# EAGLE design V1_Flight_Controller (EAGLE 9.5.1)
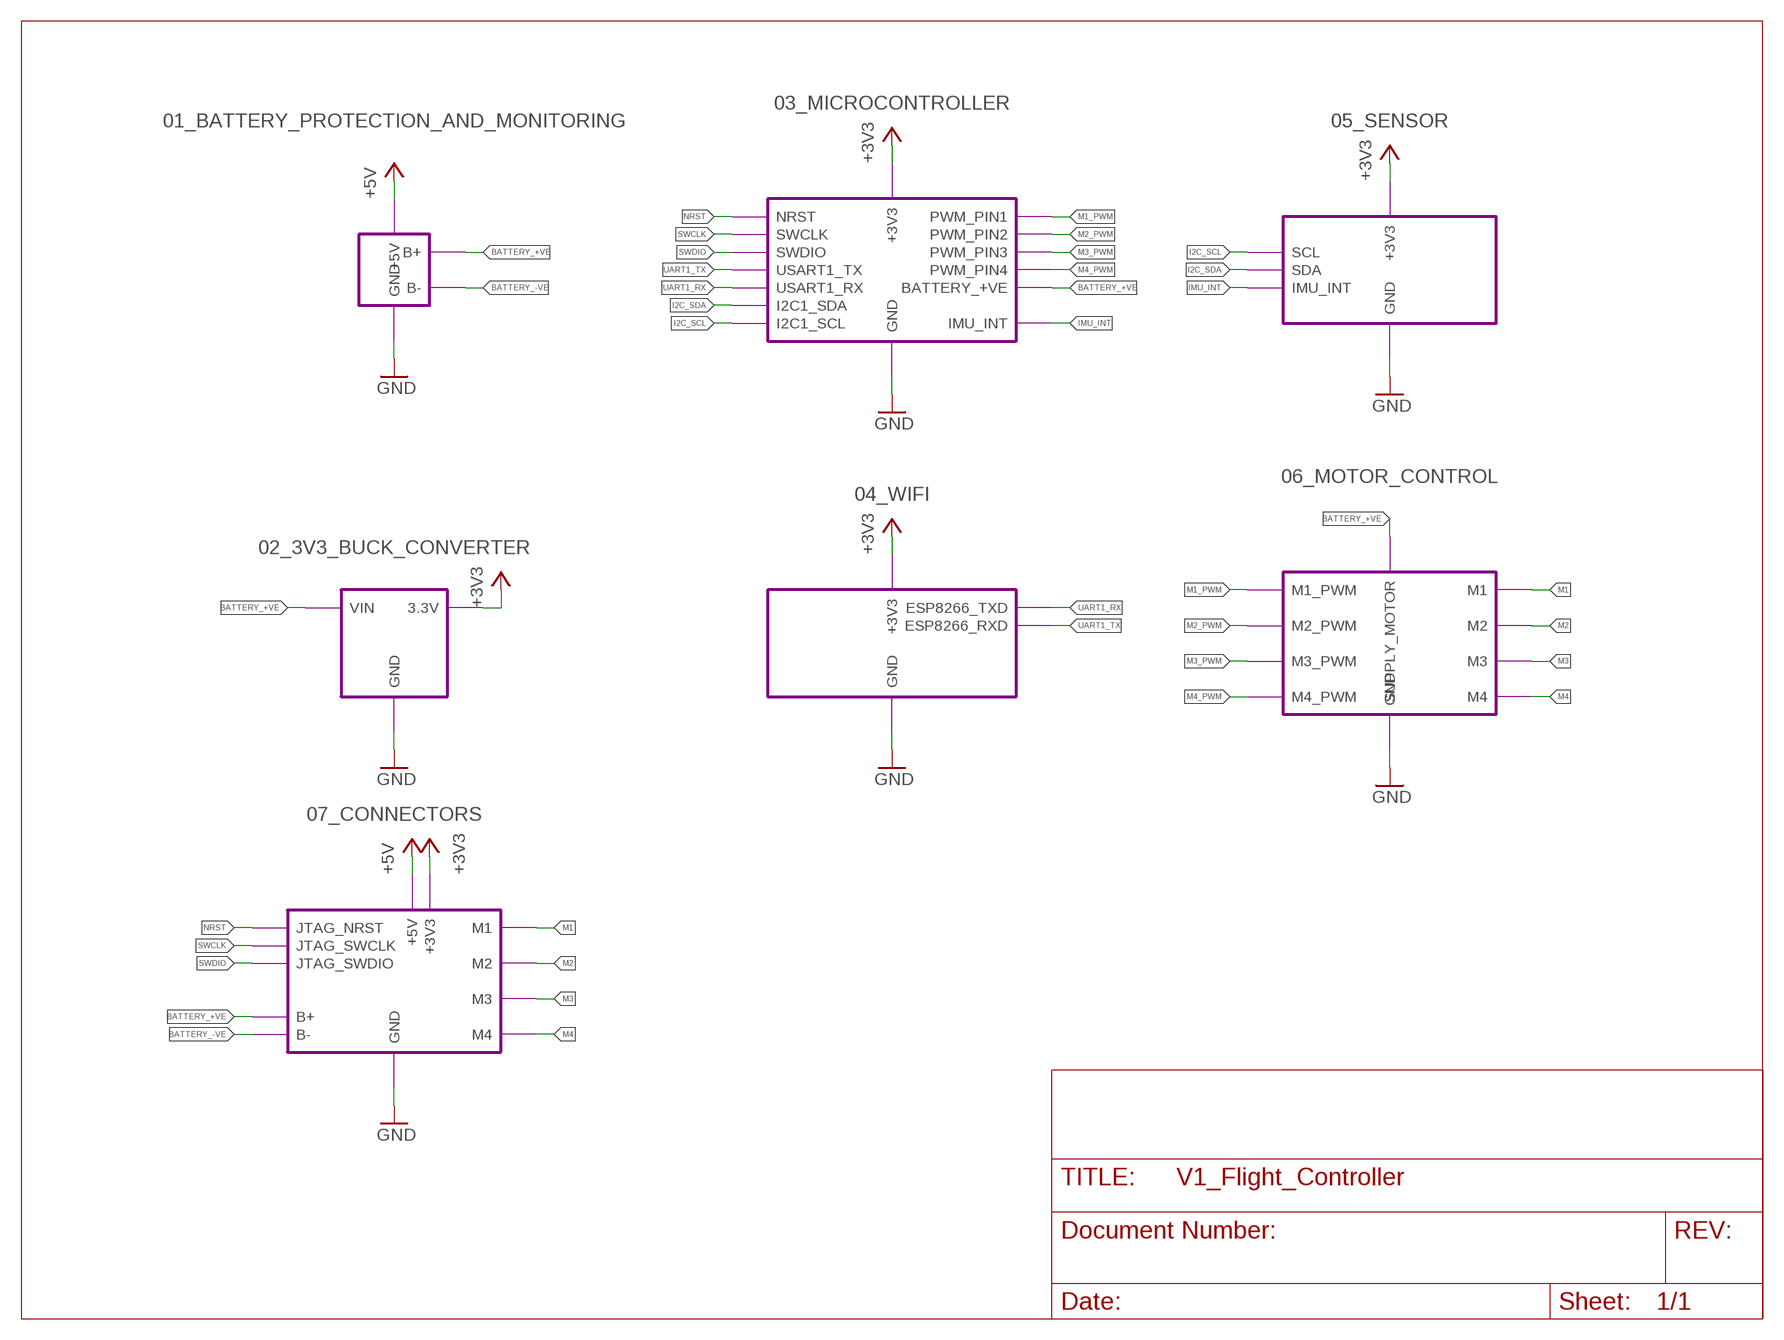
[diagram p0: schematic, sheet 1]

## Module instances
03_MICROCONTROLLER = MICROCONTROLLER
02_3V3_BUCK_CONVERTER = 3V3_BUCK_CONVERTER
01_BATTERY_PROTECTION_AND_MONITORING = BATTERY_PROTECTION_AND_MONITORING
04_WIFI = WIFI
05_SENSOR = SENSOR
06_MOTOR_CONTROL = MOTOR_CONTROL
07_CONNECTORS = CONNECTORS

## Nets
+3V3: port 07_CONNECTORS.+3V3 02_3V3_BUCK_CONVERTER.3.3V 04_WIFI.+3V3 03_MICROCONTROLLER.+3V3 05_SENSOR.+3V3
+5V: port 01_BATTERY_PROTECTION_AND_MONITORING.+5V 07_CONNECTORS.+5V
BATTERY_+VE: port 01_BATTERY_PROTECTION_AND_MONITORING.B+ 07_CONNECTORS.B+ 02_3V3_BUCK_CONVERTER.VIN 06_MOTOR_CONTROL.SUPPLY_MOTOR 03_MICROCONTROLLER.BATTERY_+VE
BATTERY_-VE: port 01_BATTERY_PROTECTION_AND_MONITORING.B- 07_CONNECTORS.B-
GND: port 01_BATTERY_PROTECTION_AND_MONITORING.GND 02_3V3_BUCK_CONVERTER.GND 04_WIFI.GND 06_MOTOR_CONTROL.GND 05_SENSOR.GND 03_MICROCONTROLLER.GND 07_CONNECTORS.GND
I2C_SCL: port 03_MICROCONTROLLER.I2C1_SCL
I2C_SDA: port 03_MICROCONTROLLER.I2C1_SDA
M1: port 07_CONNECTORS.M1 06_MOTOR_CONTROL.M1
M1_PWM: port 06_MOTOR_CONTROL.M1_PWM 03_MICROCONTROLLER.PWM_PIN1
M2: port 07_CONNECTORS.M2 06_MOTOR_CONTROL.M2
M2_PWM: port 03_MICROCONTROLLER.PWM_PIN2 06_MOTOR_CONTROL.M2_PWM
M3: port 07_CONNECTORS.M3 06_MOTOR_CONTROL.M3
M3_PWM: port 03_MICROCONTROLLER.PWM_PIN3 06_MOTOR_CONTROL.M3_PWM
M4: port 07_CONNECTORS.M4 06_MOTOR_CONTROL.M4
M4_PWM: port 03_MICROCONTROLLER.PWM_PIN4 06_MOTOR_CONTROL.M4_PWM
NRST: port 03_MICROCONTROLLER.NRST 07_CONNECTORS.JTAG_NRST
SWCLK: port 03_MICROCONTROLLER.SWCLK 07_CONNECTORS.JTAG_SWCLK
SWDIO: port 03_MICROCONTROLLER.SWDIO 07_CONNECTORS.JTAG_SWDIO
UART1_RX: port 03_MICROCONTROLLER.USART1_RX 04_WIFI.ESP8266_TXD
UART1_TX: port 03_MICROCONTROLLER.USART1_TX 04_WIFI.ESP8266_RXD

## Library data of the parts

## Module MICROCONTROLLER
Ports: PWM_PIN1(out) PWM_PIN2(out) PWM_PIN3(out) PWM_PIN4(out) NRST(io) SWCLK(io) SWDIO(io) I2C1_SCL(io) I2C1_SDA(io) USART1_TX(out) USART1_RX(in) IMU_INT(in) +3V3(pwr) GND(pwr) BATTERY_+VE(in)
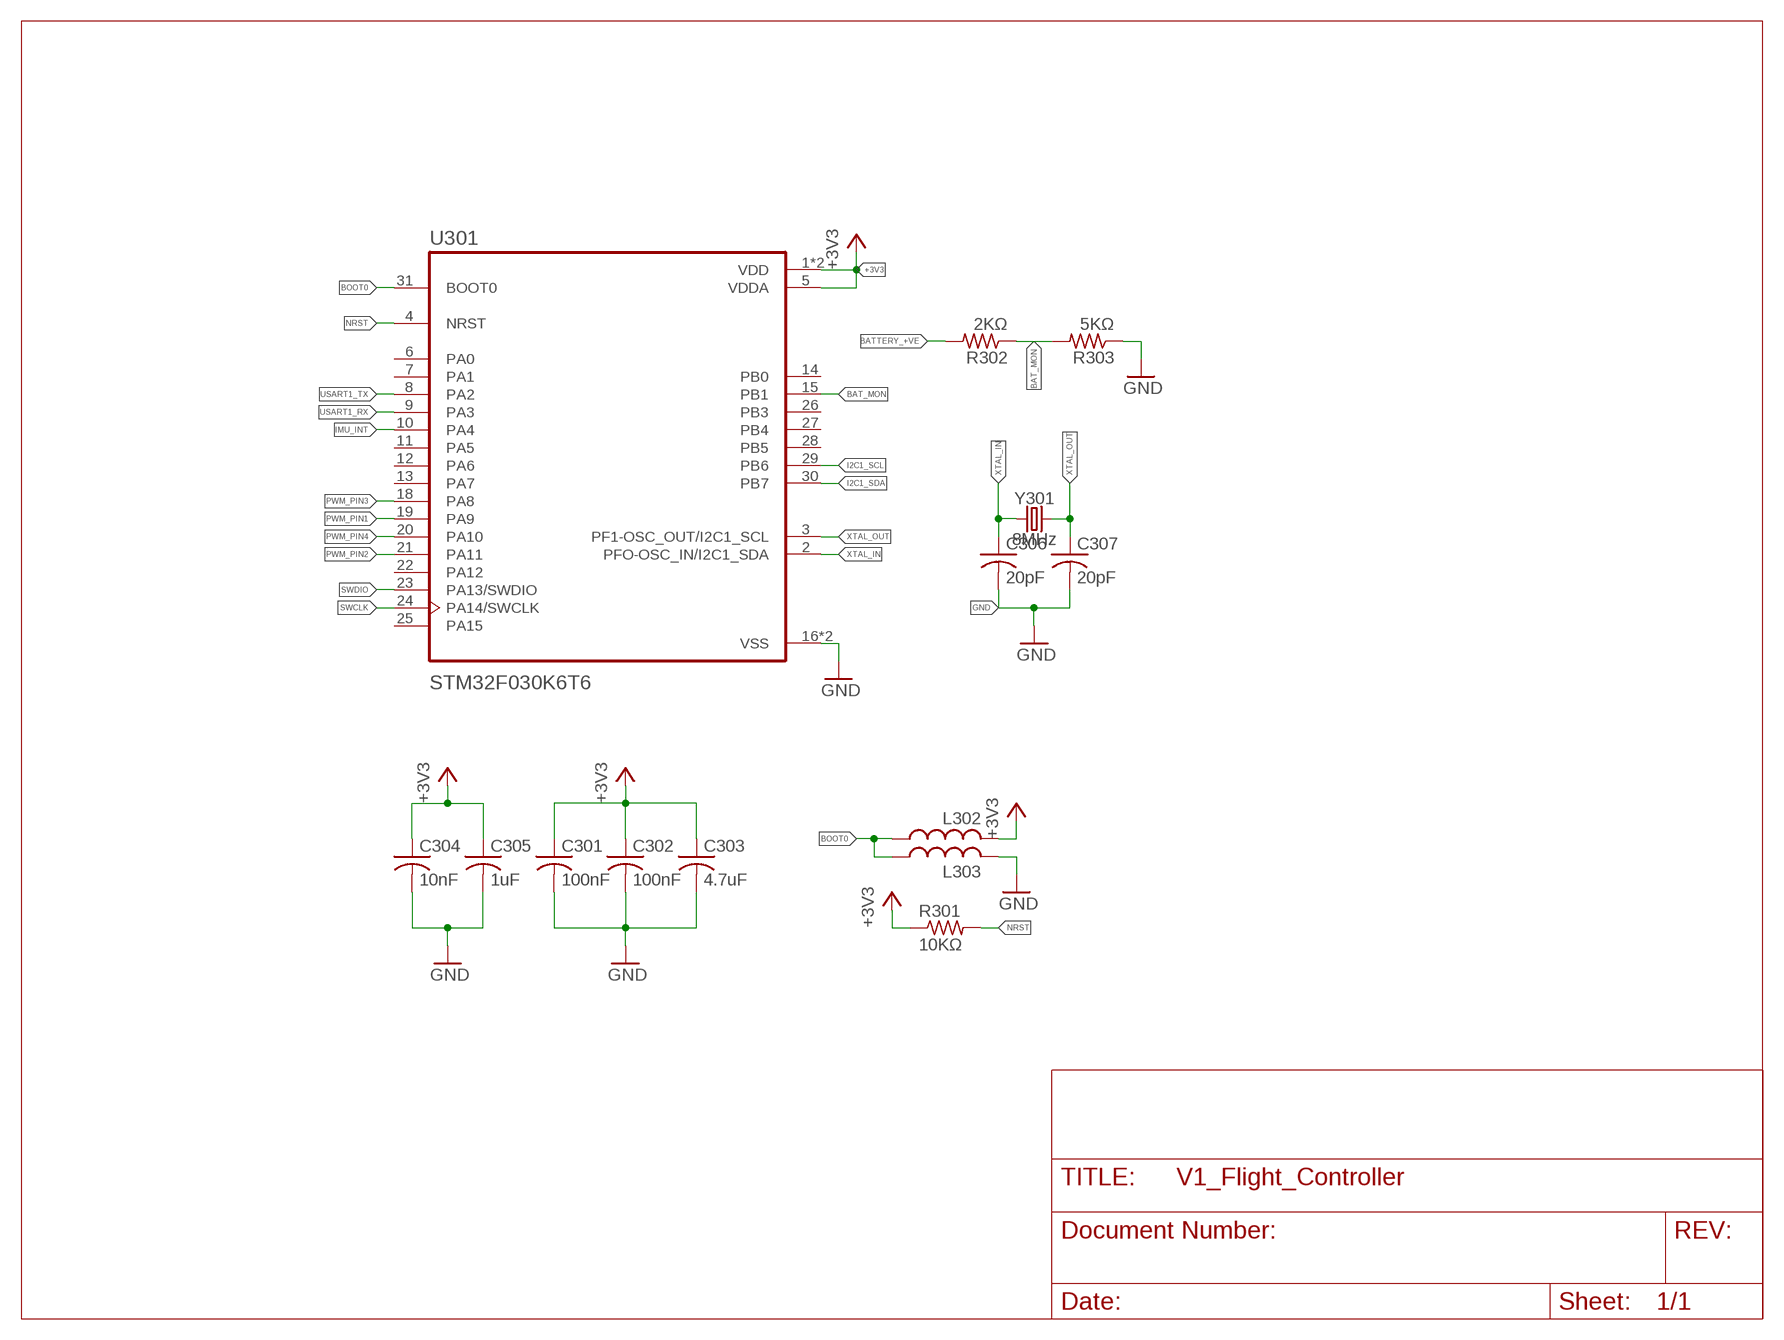
[diagram p1: schematic, module MICROCONTROLLER, sheet 1]

### Parts
C301  100nF  C-USC0603  [C0603]
C302  100nF  C-USC0603  [C0603]
C303  4.7uF  C-USC0603  [C0603]
C304  10nF  C-USC0603  [C0603]
C305  1uF  C-USC0603  [C0603]
C306  20pF  C-USC0603  [C0603]
C307  20pF  C-USC0603  [C0603]
L302  L-USL2012C  [L2012C]
L303  L-USL2012C  [L2012C]
R301  10KΩ  R-US_R0603  [R0603]
R302  2KΩ  R-US_R0603  [R0603]
R303  5KΩ  R-US_R0603  [R0603]
U301  STM32F030K6T6  [QFP80P900X900X160-32N]
Y301  8MHz  CRYSTAL-8MHZSMD-HC49UP  [HC49UP]

### Nets
+3V3: C301.1 C302.1 C303.1 C304.1 C305.1 L302.2 R301.1 U301.1(VDD) U301.5(VDDA) U301.17(VDD)
BAT_MON: R302.1 R303.2 U301.15(PB1)
BATTERY_+VE: R302.2
BOOT0: L302.1 L303.1 U301.31(BOOT0)
GND: C301.2 C302.2 C303.2 C304.2 C305.2 C306.2 C307.2 L303.2 R303.1 U301.16(VSS) U301.32(VSS)
I2C1_SCL: U301.29(PB6)
I2C1_SDA: U301.30(PB7)
IMU_INT: U301.10(PA4)
NRST: R301.2 U301.4(NRST)
PWM_PIN1: U301.19(PA9)
PWM_PIN2: U301.21(PA11)
PWM_PIN3: U301.18(PA8)
PWM_PIN4: U301.20(PA10)
SWCLK: U301.24(PA14/SWCLK)
SWDIO: U301.23(PA13/SWDIO)
USART1_RX: U301.9(PA3)
USART1_TX: U301.8(PA2)
XTAL_IN: C306.1 U301.2(PFO-OSC_IN/I2C1_SDA) Y301.1
XTAL_OUT: C307.1 U301.3(PF1-OSC_OUT/I2C1_SCL) Y301.2
Unconnected: U301.6(PA0) U301.7(PA1) U301.11(PA5) U301.12(PA6) U301.13(PA7) U301.14(PB0) U301.22(PA12) U301.25(PA15) U301.26(PB3) U301.27(PB4) U301.28(PB5)

### Library data of the parts
C301-C307 = adafruit:C-US: CAPACITOR, American symbol
L302 L303 = rcl:L-US: INDUCTOR, American symbol; SPICEPREFIX: L
R301-R303 = adafruit:R-US_: RESISTOR, American symbol
U301 = STM32F030K6T6:STM32F030K6T6: None; AVAILABILITY: Unavailable; DESCRIPTION: MCU 32-Bit STM32F ARM Cortex M0 RISC 32KB Flash 2.5V/3.3V 32-Pin LQFP Tray; MF: STMicroelectronics; MP: STM32F030K6T6; PACKAGE: LQFP-32 STMicroelectronics; PRICE: None
Y301 = SparkFun-Clocks:CRYSTAL-8MHZ: 8MHz Crystal Datasheet Example <http://www.futureelectronics.com/en/technologies/electromechanical/timing-devices/crystals/Pages/6008189-ABM3B-8.000MHZ-B2-T.aspx?IM=0> Frequency: 8MHz Frequency Tolerance: ±20ppm Load Capacitance: 18pF SparkFun Products: Pro Micro -3.3V/8MHz <https://www.sparkfun.com/products/12587> WAV Trigger <https://www.sparkfun.com/products/13660>; PROD_ID: XTAL-11706

## Module 3V3_BUCK_CONVERTER
Ports: VIN(in) 3.3V(pwr) GND(pwr)
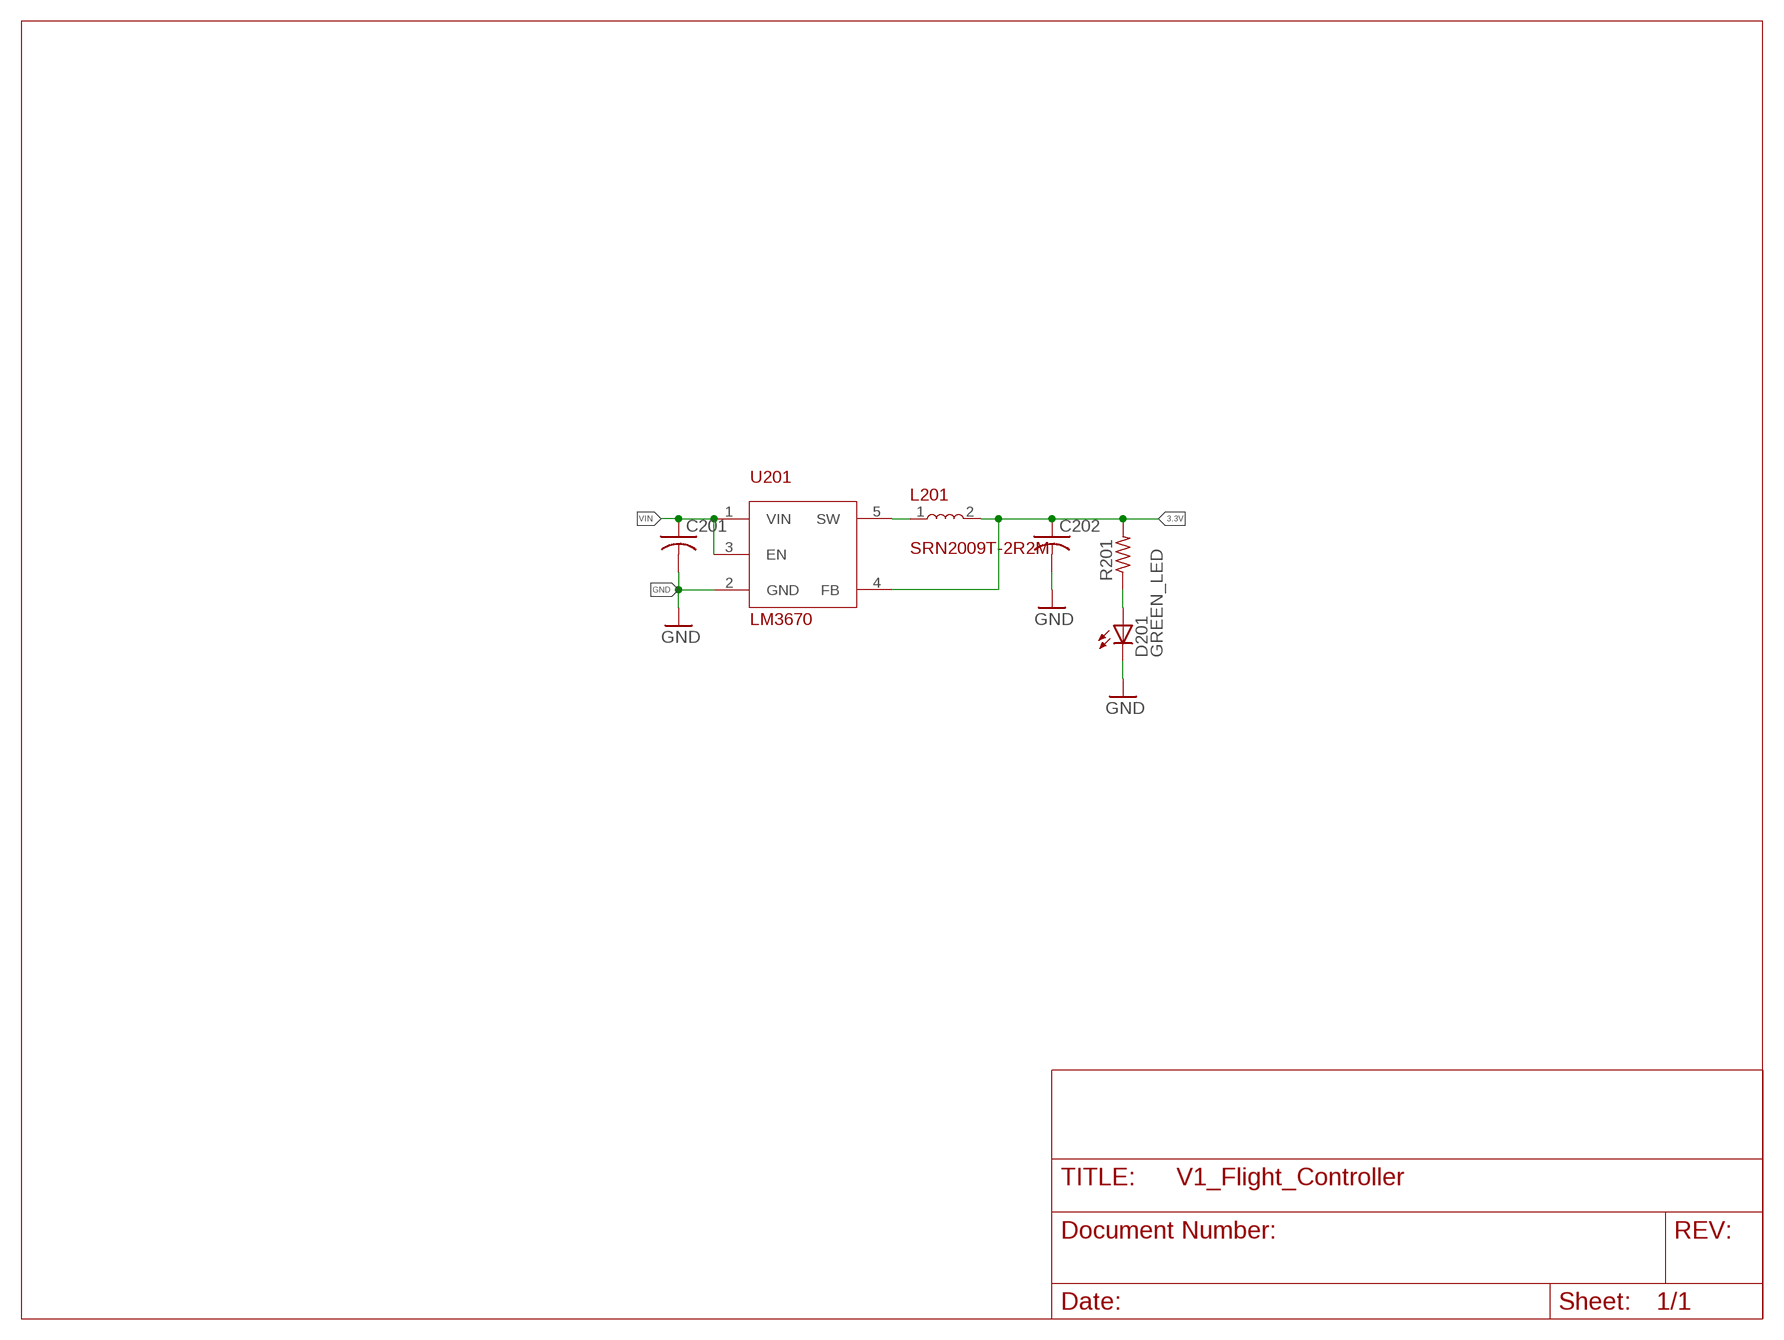
[diagram p2: schematic, module 3V3_BUCK_CONVERTER, sheet 1]

### Parts
C201  C-USC0603K  [C0603K]
C202  C-USC0603K  [C0603K]
D201  GREEN_LED  LEDCHIPLED_0603  [CHIPLED_0603]
L201  SRN2009T-2R2M  [SRN2009T-2R2M]
R201  R-US_R0603  [R0603]
U201  LM3670  [SOT-23-5]

### Nets
3.3V: C202.1 L201.2 R201.2 U201.4(FB)
GND: C201.2 C202.2 D201.C U201.2(GND)
LED_3V3: D201.A R201.1
SW: L201.1 U201.5(SW)
VIN: C201.1 U201.1(VIN) U201.3(EN)

### Library data of the parts
C201 C202 = adafruit:C-US: CAPACITOR, American symbol
D201 = adafruit:LED: LED OSRAM: - CHIPLED LG R971, LG N971, LY N971, LG Q971, LY Q971, LO R971, LY R971 LH N974, LH R974 LS Q976, LO Q976, LY Q976 LO Q996 - Hyper CHIPLED LW Q18S LB Q993, LB Q99A, LB R99A - SideLED LS A670, LO A670, LY A670, LG A670, LP A670 LB A673, LV A673, LT A673, LW A673 LH A674 LY A675 LS A676, LA A676, LO A676, LY A676, LW A676 LS A679, LY A679, LG A679 - Hyper Micro SIDELED® LS Y876, LA Y876, LO Y876, LY Y876 LT Y87S - SmartLED LW L88C, LW L88S LB L89C, LB L89S, LG L890 LS L89K, LO L89K, LY L89K LS L896, LA L896, LO L896, LY L896 - TOPLED LS T670, LO T670, LY T670, LG T670, LP T670 LSG T670, LSP T670, LSY T670, LOP T670, LYG T670 LG T671, LOG T671, LSG T671 LB T673, LV T673, LT T673, LW T673 LH T674 LS T676, LA T676, LO T676, LY T676, LB T676, LH T676, LSB T676, LW T676 LB T67C, LV T67C, LT T67C, LS T67K, LO T67K, LY T67K, LW E67C LS E67B, LA E67B, LO E67B, LY E67B, LB E67C, LV E67C, LT E67C LW T67C LS T679, LY T679, LG T679 LS T770, LO T770, LY T770, LG T770, LP T770 LB T773, LV T773, LT T773, LW T773 LH T774 LS E675, LA E675, LY E675, LS T675 LS T776, LA T776, LO T776, LY T776, LB T776 LHGB T686 LT T68C, LB T68C - Hyper Mini TOPLED® LB M676 - Mini TOPLED Santana® LG M470 LS M47K, LO M47K, LY M47K Source: http://www.osram.convergy.de/
L201 = SRN2009T-2R2M:SRN2009T-2R2M
R201 = adafruit:R-US_: RESISTOR, American symbol
U201 = smd-footprints:LM3670

## Module BATTERY_PROTECTION_AND_MONITORING
Ports: GND(pwr) B+(io) B-(in) +5V(pwr)
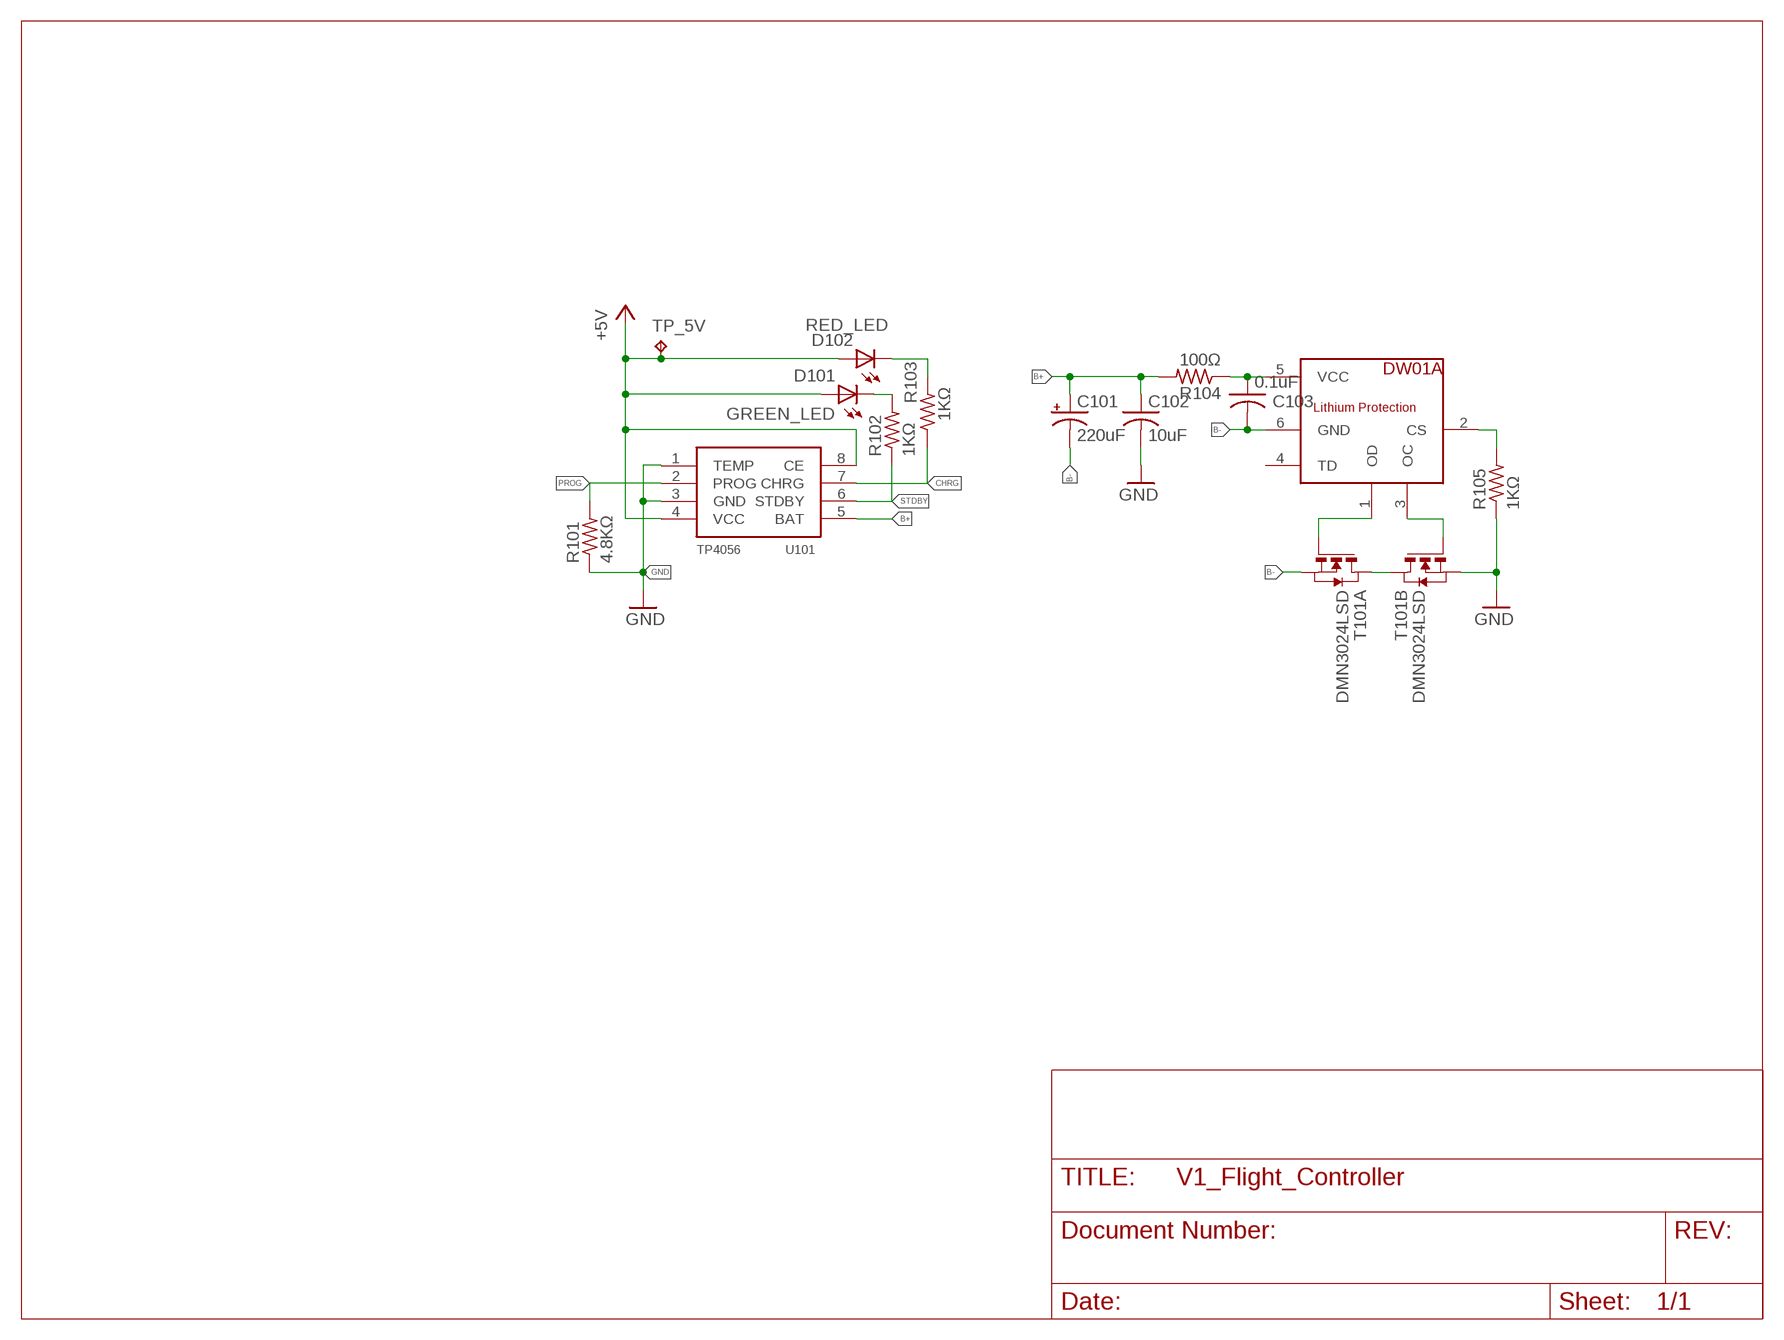
[diagram p3: schematic, module BATTERY_PROTECTION_AND_MONITORING, sheet 1]

### Parts
C101  220uF  CPOL-USD  [PANASONIC_D]
C102  10uF  C-USC0603K  [C0603K]
C103  0.1uF  C-USC0603K  [C0603K]
D101  GREEN_LED  LEDCHIPLED_0603  [CHIPLED_0603]
D102  RED_LED  LEDCHIPLED_0603  [CHIPLED_0603]
R101  4.8KΩ  R-US_R0603  [R0603]
R102  1KΩ  R-US_R0603  [R0603]
R103  1KΩ  R-US_R0603  [R0603]
R104  100Ω  R-US_R0603  [R0603]
R105  1KΩ  R-US_R0603  [R0603]
T101  DMN3024LSD  [TSSOP-8]
TP_5V  TPB1,27  [B1,27]
U101  TP4056  [SOP-8]
U102  DW01A  [SOT23-6]

### Nets
+5V: D101.A D102.A TP_5V.TP U101.4(VCC) U101.8(CE)
B+: C101.+ C102.1 R104.2 U101.5(BAT)
B-: C101.- C103.2 T101.2(A:S) T101.3(A:S) U102.6(GND)
CHRG: R103.1 U101.7(CHRG)
CHRG_LED: D102.C R103.2
CS: R105.2 U102.2(CS)
GND: C102.2 R101.1 R105.1 T101.6(B:S) T101.7(B:S) U101.1(TEMP) U101.3(GND)
N$6: T101.1(A:D) T101.8(B:D)
OC: T101.5(B:G) U102.3(OC)
OD: T101.4(A:G) U102.1(OD)
PROG: R101.2 U101.2(PROG)
STDBY: R102.1 U101.6(STDBY)
STDBY_LED: D101.C R102.2
VCC: C103.1 R104.1 U102.5(VCC)
Unconnected: U102.4(TD)

### Library data of the parts
C101 = adafruit:CPOL-US: POLARIZED CAPACITOR, American symbol
C102 C103 = adafruit:C-US: CAPACITOR, American symbol
D101 D102 = adafruit:LED: LED OSRAM: - CHIPLED LG R971, LG N971, LY N971, LG Q971, LY Q971, LO R971, LY R971 LH N974, LH R974 LS Q976, LO Q976, LY Q976 LO Q996 - Hyper CHIPLED LW Q18S LB Q993, LB Q99A, LB R99A - SideLED LS A670, LO A670, LY A670, LG A670, LP A670 LB A673, LV A673, LT A673, LW A673 LH A674 LY A675 LS A676, LA A676, LO A676, LY A676, LW A676 LS A679, LY A679, LG A679 - Hyper Micro SIDELED® LS Y876, LA Y876, LO Y876, LY Y876 LT Y87S - SmartLED LW L88C, LW L88S LB L89C, LB L89S, LG L890 LS L89K, LO L89K, LY L89K LS L896, LA L896, LO L896, LY L896 - TOPLED LS T670, LO T670, LY T670, LG T670, LP T670 LSG T670, LSP T670, LSY T670, LOP T670, LYG T670 LG T671, LOG T671, LSG T671 LB T673, LV T673, LT T673, LW T673 LH T674 LS T676, LA T676, LO T676, LY T676, LB T676, LH T676, LSB T676, LW T676 LB T67C, LV T67C, LT T67C, LS T67K, LO T67K, LY T67K, LW E67C LS E67B, LA E67B, LO E67B, LY E67B, LB E67C, LV E67C, LT E67C LW T67C LS T679, LY T679, LG T679 LS T770, LO T770, LY T770, LG T770, LP T770 LB T773, LV T773, LT T773, LW T773 LH T774 LS E675, LA E675, LY E675, LS T675 LS T776, LA T776, LO T776, LY T776, LB T776 LHGB T686 LT T68C, LB T68C - Hyper Mini TOPLED® LB M676 - Mini TOPLED Santana® LG M470 LS M47K, LO M47K, LY M47K Source: http://www.osram.convergy.de/
R101-R105 = adafruit:R-US_: RESISTOR, American symbol
T101 = FS8205A:DMN3024LSD: DUAL N-CHANNEL ENHANCEMENT MODE MOSFET data sheet <http://goo.gl/dRgboR> Dave.Calaway Eagle Library <https://goo.gl/Muy1Tr>
TP_5V = testpad:TP: Test pad
U101 = tp4056:TP4056
U102 = dw01a:DW01A

## Module WIFI
Ports: ESP8266_TXD(out) ESP8266_RXD(in) +3V3(pwr) GND(pwr)
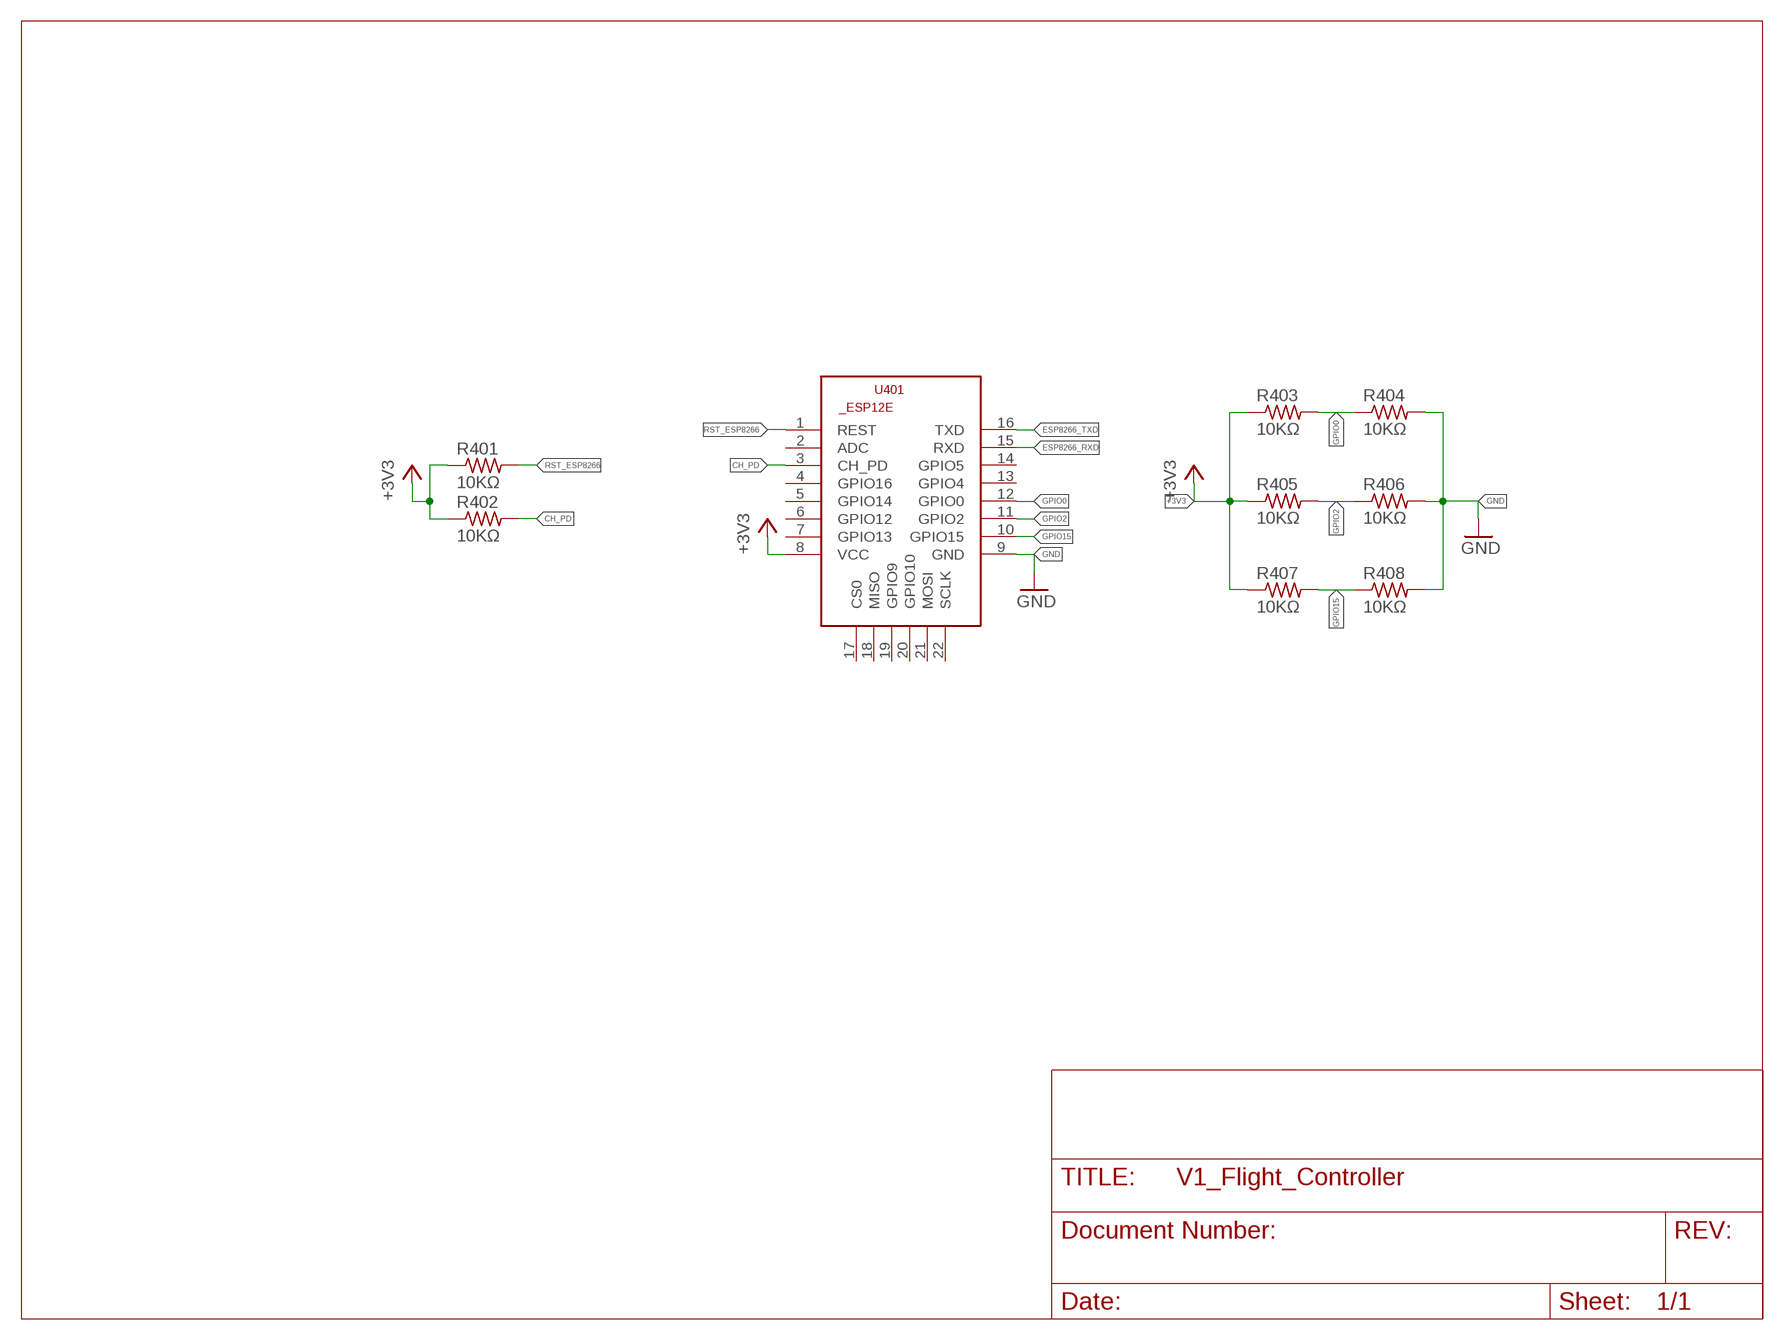
[diagram p4: schematic, module WIFI, sheet 1]

### Parts
R401  10KΩ  R-US_R0603  [R0603]
R402  10KΩ  R-US_R0603  [R0603]
R403  10KΩ  R-US_R0603  [R0603]
R404  10KΩ  R-US_R0603  [R0603]
R405  10KΩ  R-US_R0603  [R0603]
R406  10KΩ  R-US_R0603  [R0603]
R407  10KΩ  R-US_R0603  [R0603]
R408  10KΩ  R-US_R0603  [R0603]
U401  ESP8266-12EESP12E  [ESP8266-ESP12E]

### Nets
+3V3: R401.1 R402.1 R403.1 R405.1 R407.1 U401.8(VCC)
CH_PD: R402.2 U401.3(CH_PD)
ESP8266_RXD: U401.15(RXD)
ESP8266_TXD: U401.16(TXD)
GND: R404.2 R406.2 R408.2 U401.9(GND)
GPIO0: R403.2 R404.1 U401.12(GPIO0)
GPIO2: R405.2 R406.1 U401.11(GPIO2)
GPIO15: R407.2 R408.1 U401.10(GPIO15)
RST_ESP8266: R401.2 U401.1(REST)
Unconnected: U401.2(ADC) U401.4(GPIO16) U401.5(GPIO14) U401.6(GPIO12) U401.7(GPIO13) U401.13(GPIO4) U401.14(GPIO5) U401.17(CS0) U401.18(MISO) U401.19(GPIO9) U401.20(GPIO10) U401.21(MOSI) U401.22(SCLK)

### Library data of the parts
R401-R408 = adafruit:R-US_: RESISTOR, American symbol
U401 = esp12e:ESP8266-12E: ESP8266-12E Library for Eagle CAD The author not responsible for any damages or errors!. Created by Suhail jr.lt;/author>

## Module SENSOR
Ports: SCL(io) SDA(io) IMU_INT(out) GND(pwr) +3V3(pwr)
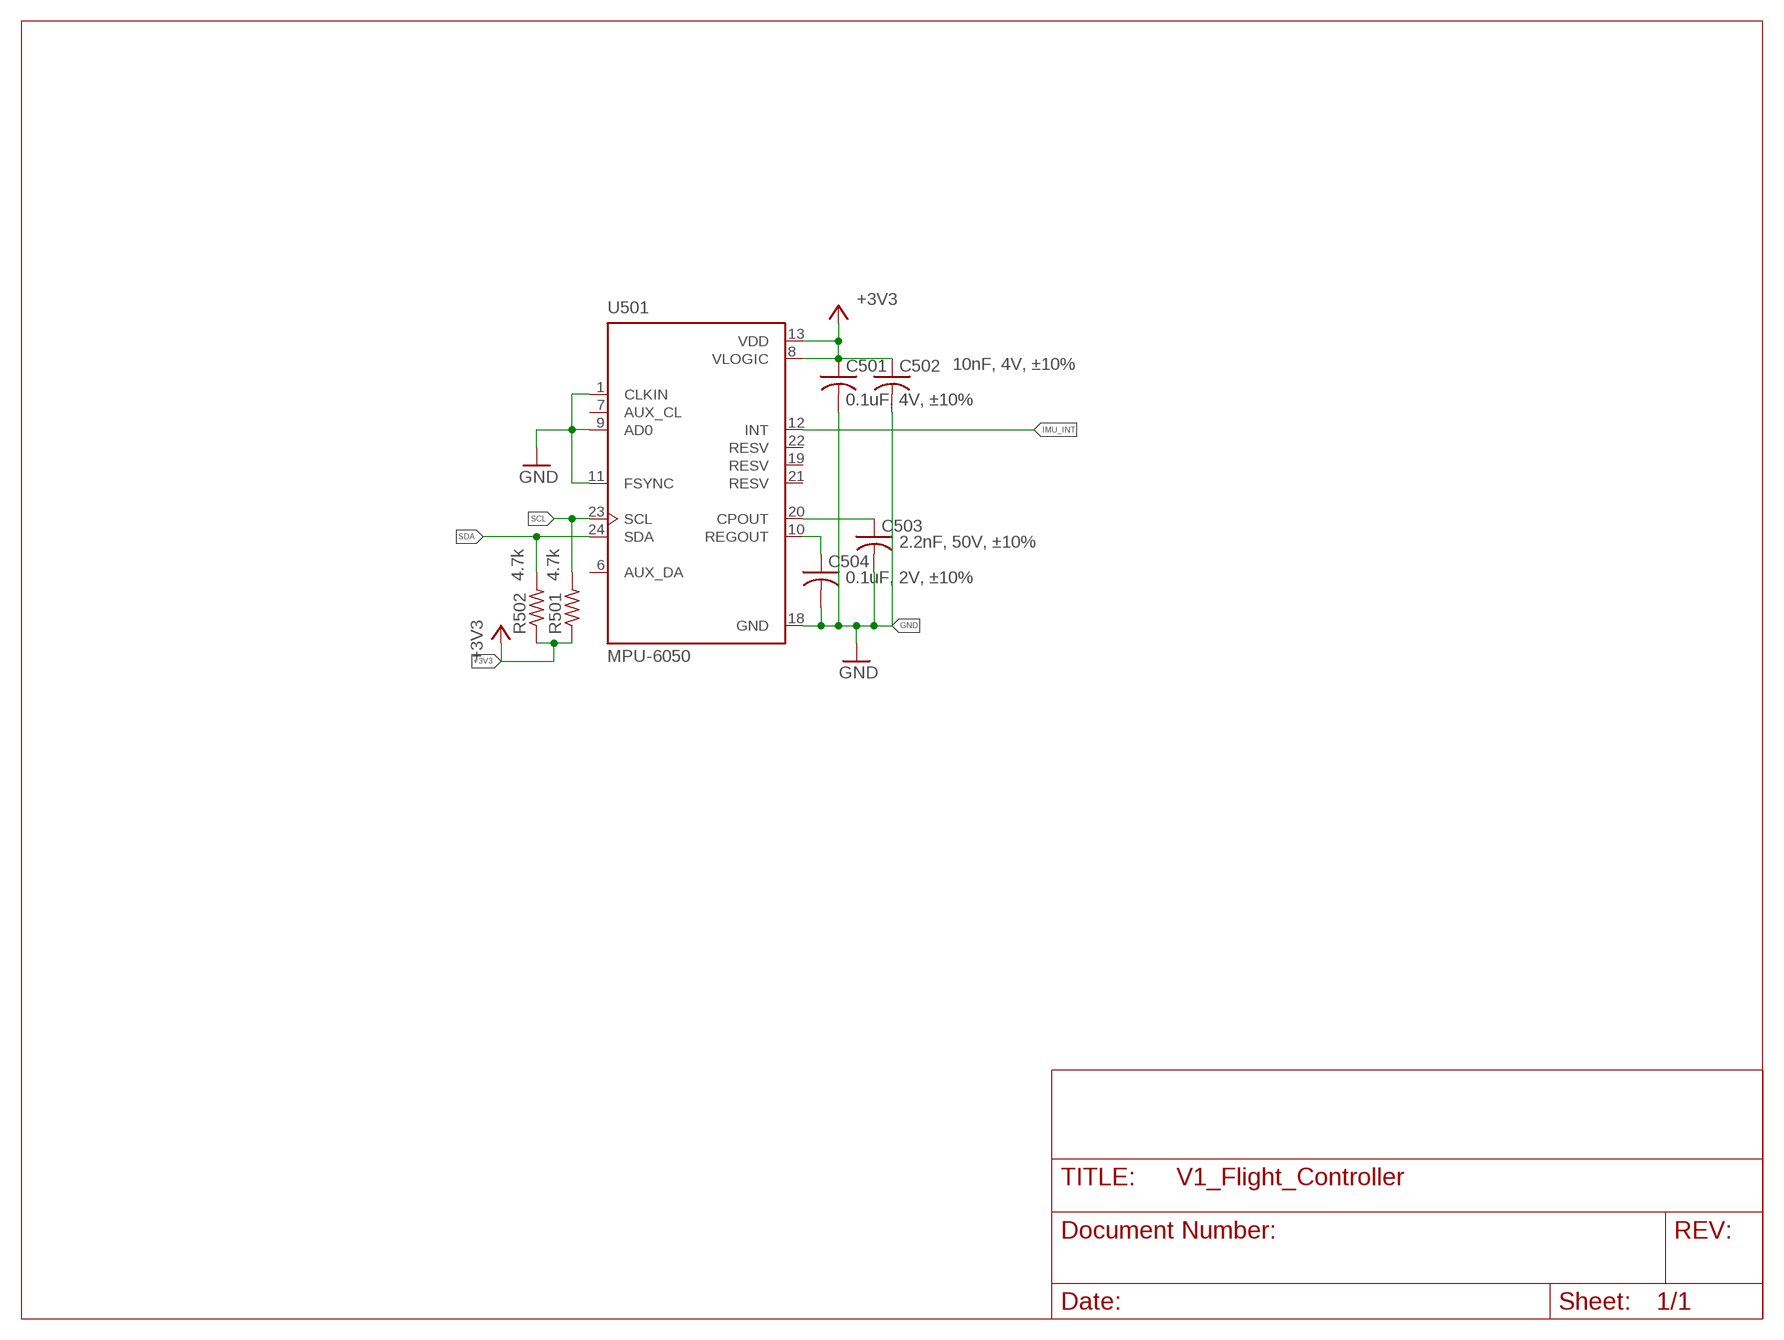
[diagram p5: schematic, module SENSOR, sheet 1]

### Parts
C501  0.1uF, 4V, ±10%  C-USC0603  [C0603]
C502  10nF, 4V, ±10%  C-USC0603  [C0603]
C503  2.2nF, 50V, ±10%  C-USC0603  [C0603]
C504  0.1uF, 2V, ±10%  C-USC0603  [C0603]
R501  4.7k  R-US_R0603  [R0603]
R502  4.7k  R-US_R0603  [R0603]
U501  MPU-6050  [QFN50P400X400X95-24N]

### Nets
+3V3: C501.1 C502.1 R501.1 R502.1 U501.8(VLOGIC) U501.13(VDD)
CPOUT: C503.1 U501.20(CPOUT)
GND: C501.2 C502.2 C503.2 C504.2 U501.1(CLKIN) U501.9(AD0) U501.11(FSYNC) U501.18(GND)
IMU_INT: U501.12(INT)
REGOUT: C504.1 U501.10(REGOUT)
SCL: R501.2 U501.23(SCL)
SDA: R502.2 U501.24(SDA)
Unconnected: U501.6(AUX_DA) U501.7(AUX_CL) U501.19(RESV) U501.21(RESV) U501.22(RESV)

### Library data of the parts
C501-C504 = adafruit:C-US: CAPACITOR, American symbol
R501 R502 = adafruit:R-US_: RESISTOR, American symbol
U501 = MPU-6050:MPU-6050: MPU-6050 Six-Axis (Gyro + Accelerometer) MEMS MotionTracking™ Devices; AVAILABILITY: Unavailable; DESCRIPTION: 3-axis gyroscope, 3-axis accelerometer in a 4x4x0.9 housing; MF: TDK InvenSense; MP: MPU-6050; PACKAGE: QFN-24 InvenSense; PRICE: None

## Module MOTOR_CONTROL
Ports: SUPPLY_MOTOR(in) M1(in) M1_PWM(in) M2_PWM(in) M3_PWM(in) M4_PWM(in) M2(in) M3(in) M4(in) GND(pwr)
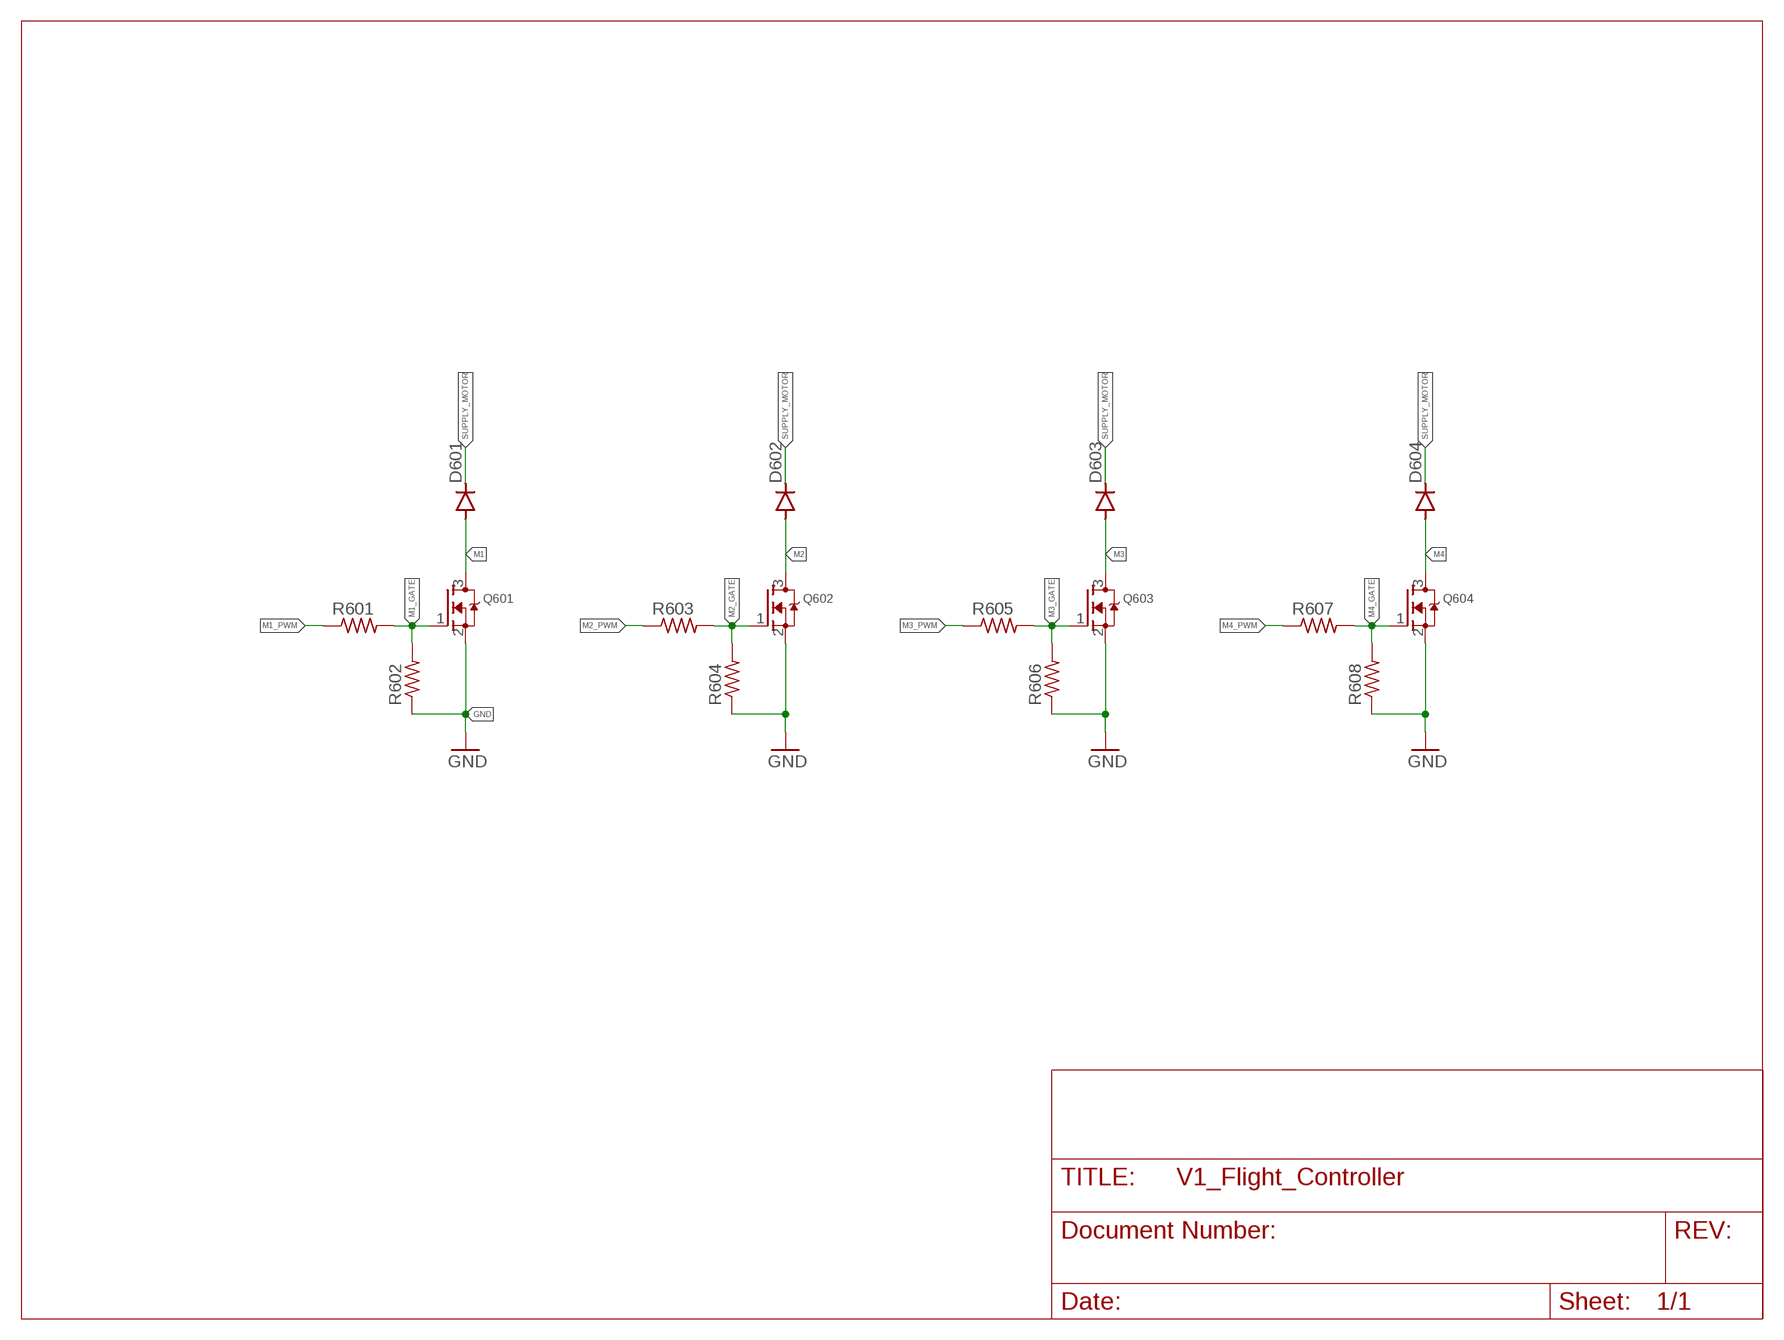
[diagram p6: schematic, module MOTOR_CONTROL, sheet 1]

### Parts
D601  DIODE-SOD123  [SOD123]
D602  DIODE-SOD123  [SOD123]
D603  DIODE-SOD123  [SOD123]
D604  DIODE-SOD123  [SOD123]
Q601  MOSFET-NREFLOW  [SOT23]
Q602  MOSFET-NREFLOW  [SOT23]
Q603  MOSFET-NREFLOW  [SOT23]
Q604  MOSFET-NREFLOW  [SOT23]
R601  R-US_R0603  [R0603]
R602  R-US_R0603  [R0603]
R603  R-US_R0603  [R0603]
R604  R-US_R0603  [R0603]
R605  R-US_R0603  [R0603]
R606  R-US_R0603  [R0603]
R607  R-US_R0603  [R0603]
R608  R-US_R0603  [R0603]

### Nets
GND: Q601.2(S) Q602.2(S) Q603.2(S) Q604.2(S) R602.1 R604.1 R606.1 R608.1
M1: D601.A Q601.3(D)
M1_GATE: Q601.1(G) R601.2 R602.2
M1_PWM: R601.1
M2: D602.A Q602.3(D)
M2_GATE: Q602.1(G) R603.2 R604.2
M2_PWM: R603.1
M3: D603.A Q603.3(D)
M3_GATE: Q603.1(G) R605.2 R606.2
M3_PWM: R605.1
M4: D604.A Q604.3(D)
M4_GATE: Q604.1(G) R607.2 R608.2
M4_PWM: R607.1
SUPPLY_MOTOR: D601.C D602.C D603.C D604.C

### Library data of the parts
D601-D604 = diode:DIODE-: DIODE
Q601-Q604 = adafruit:MOSFET-N: N-Channel Mosfet 2N7002E - 60V 260mA SOT23 [Digikey: 2N7002ET1GOSTR-ND] - REEL BSH103 - 30V 850mA SOT23 [Digikey: 568-5013-1-ND]
R601-R608 = adafruit:R-US_: RESISTOR, American symbol

## Module CONNECTORS
Ports: JTAG_NRST(io) JTAG_SWCLK(io) JTAG_SWDIO(io) +5V(pwr) GND(pwr) B+(out) B-(out) +3V3(pwr) M1(out) M2(out) M3(out) M4(out)
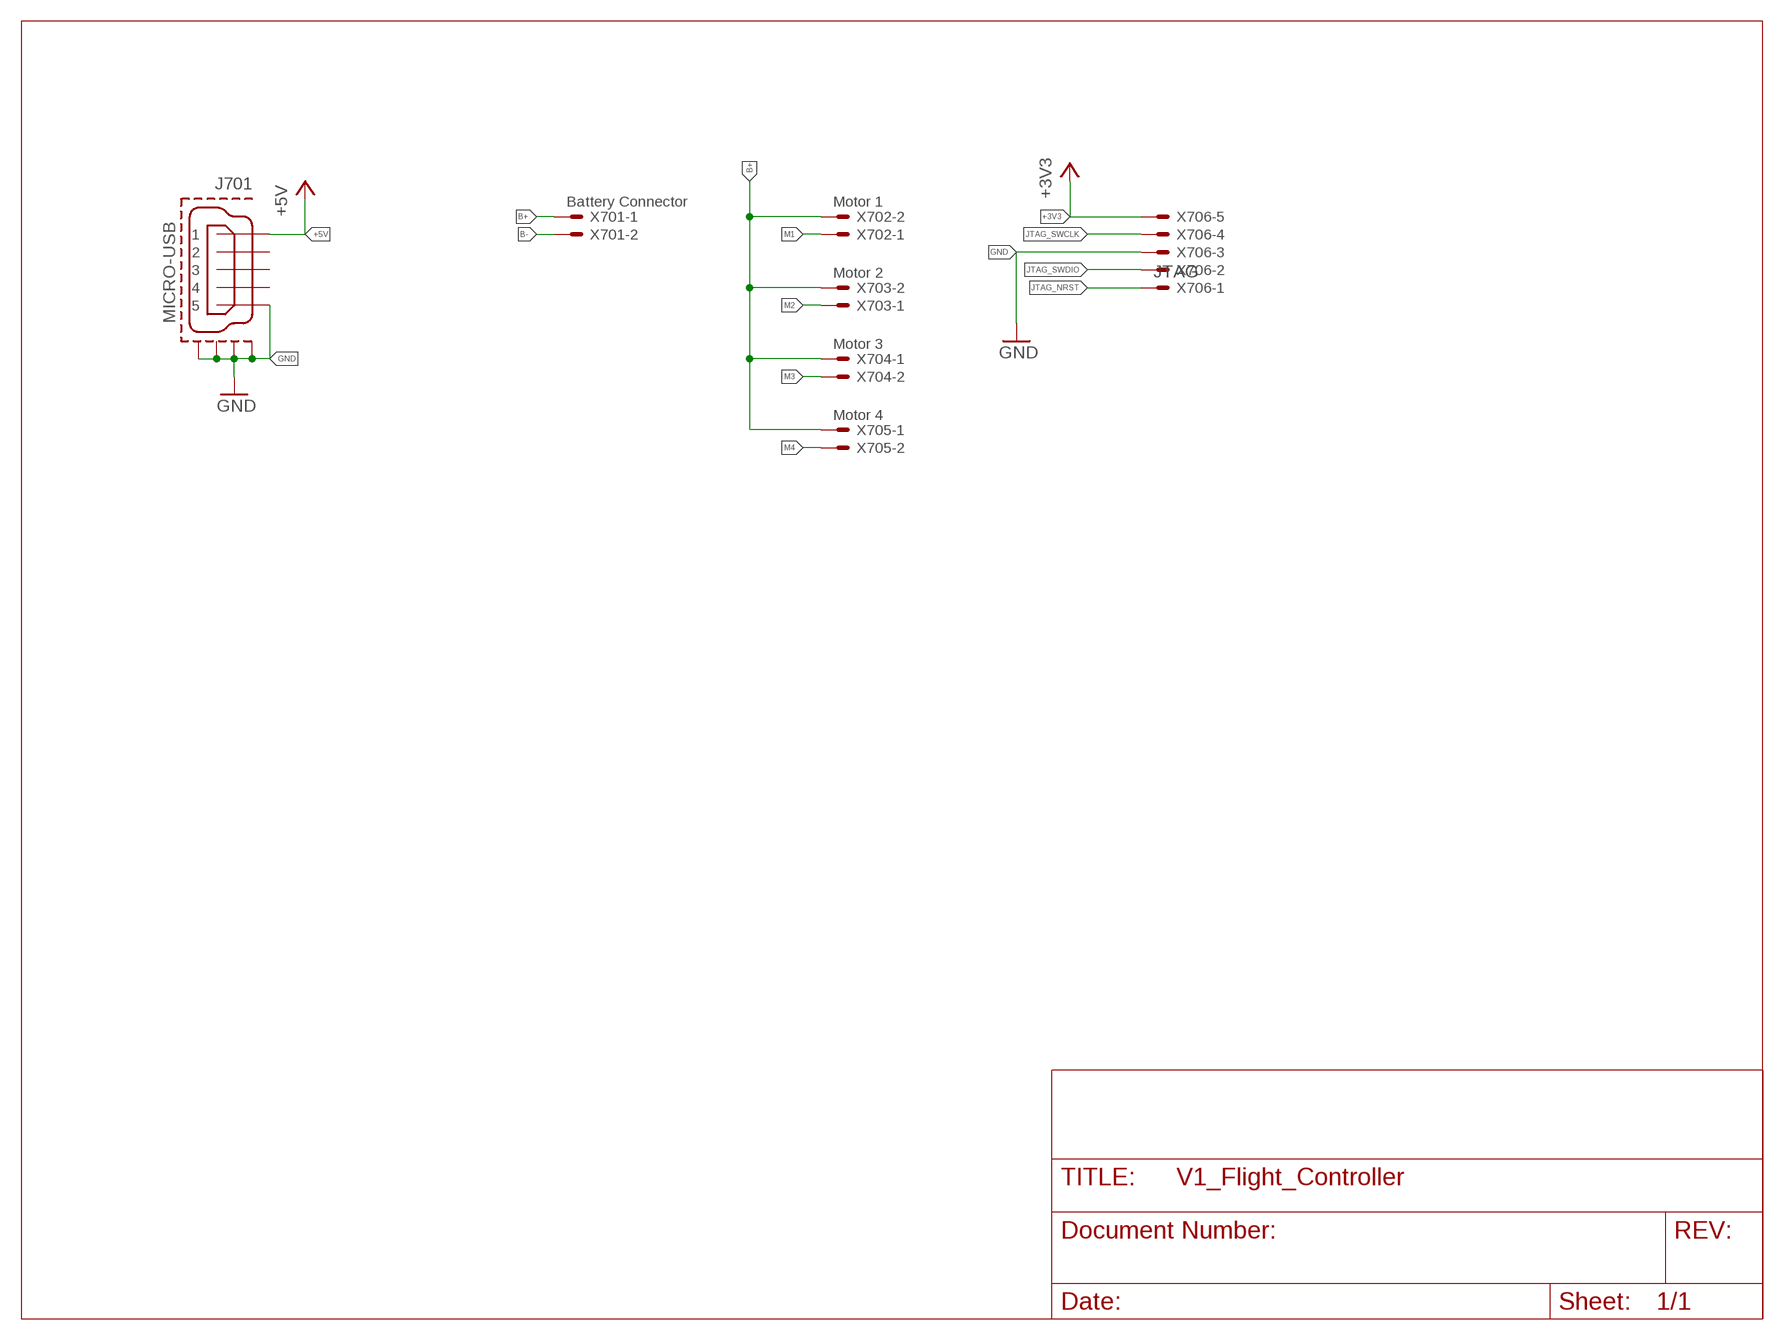
[diagram p7: schematic, module CONNECTORS, sheet 1]

### Parts
J701  MICRO-USB  MICRO-USB-RECEPTACLE47589-0001  [47589-0001]
X701  Battery Connector  SM02B-SRSS-TB  [SM02B-SRSS-TB]
X702  Motor 1  SM02B-SRSS-TB  [SM02B-SRSS-TB]
X703  Motor 2  SM02B-SRSS-TB  [SM02B-SRSS-TB]
X704  Motor 3  SM02B-SRSS-TB  [SM02B-SRSS-TB]
X705  Motor 4  SM02B-SRSS-TB  [SM02B-SRSS-TB]
X706  JTAG  53047-05  [53047-05]

### Nets
+3V3: X706.5
+5V: J701.1
B+: X701.1 X702.2 X703.2 X704.1 X705.1
B-: X701.2
GND: J701.5 J701.CASING1(GND1) J701.CASING2(GND2) J701.CASING3(GND3) J701.CASING4(GND4) X706.3
JTAG_NRST: X706.1
JTAG_SWCLK: X706.4
JTAG_SWDIO: X706.2
M1: X702.1
M2: X703.1
M3: X704.2
M4: X705.2
Unconnected: J701.2 J701.3 J701.4

### Library data of the parts
J701 = con-molex-usb:MICRO-USB-RECEPTACLE: MICRO USB RECEPTACLES Micro-USB Receptacles, SMT, Lead-Free from MOLEX <http://www.molex.com/>. (C) 2014 Tomasz Boleslaw CEDRO, cederom@tlen.pl, http://www.tomek.cedro.info. Version 0.1 (2014-01-17): Initial release. Version 0.2 (2014-02-06): Updated 47589-0001 footprint pins/pads/milling. Following devices are included: 1. 47589-0001 Micro-USB AB Receptacle, Bottom Mount, SMT, Lead-Free <http://www.molex.com/molex/products/datasheet.jsp?part=active/0475890001_IO_CONNECTORS.xml> (Technical Drawing <http://www.molex.com/pdm_docs/sd/475890001_sd.pdf>).
X701-X705 = con-jst:?M02B-SRSS-TB: Disconnectable Crimp style connector, 1.0mm pitch 2 contacts
X706 = con-molex:53?-05: CONNECTOR wire to board 1.25 mm (.049 inch) pitch header; MF: MOLEX; MPN: 53047-0510; OC_FARNELL: 9732861; OC_NEWARK: 38C9901

## Board
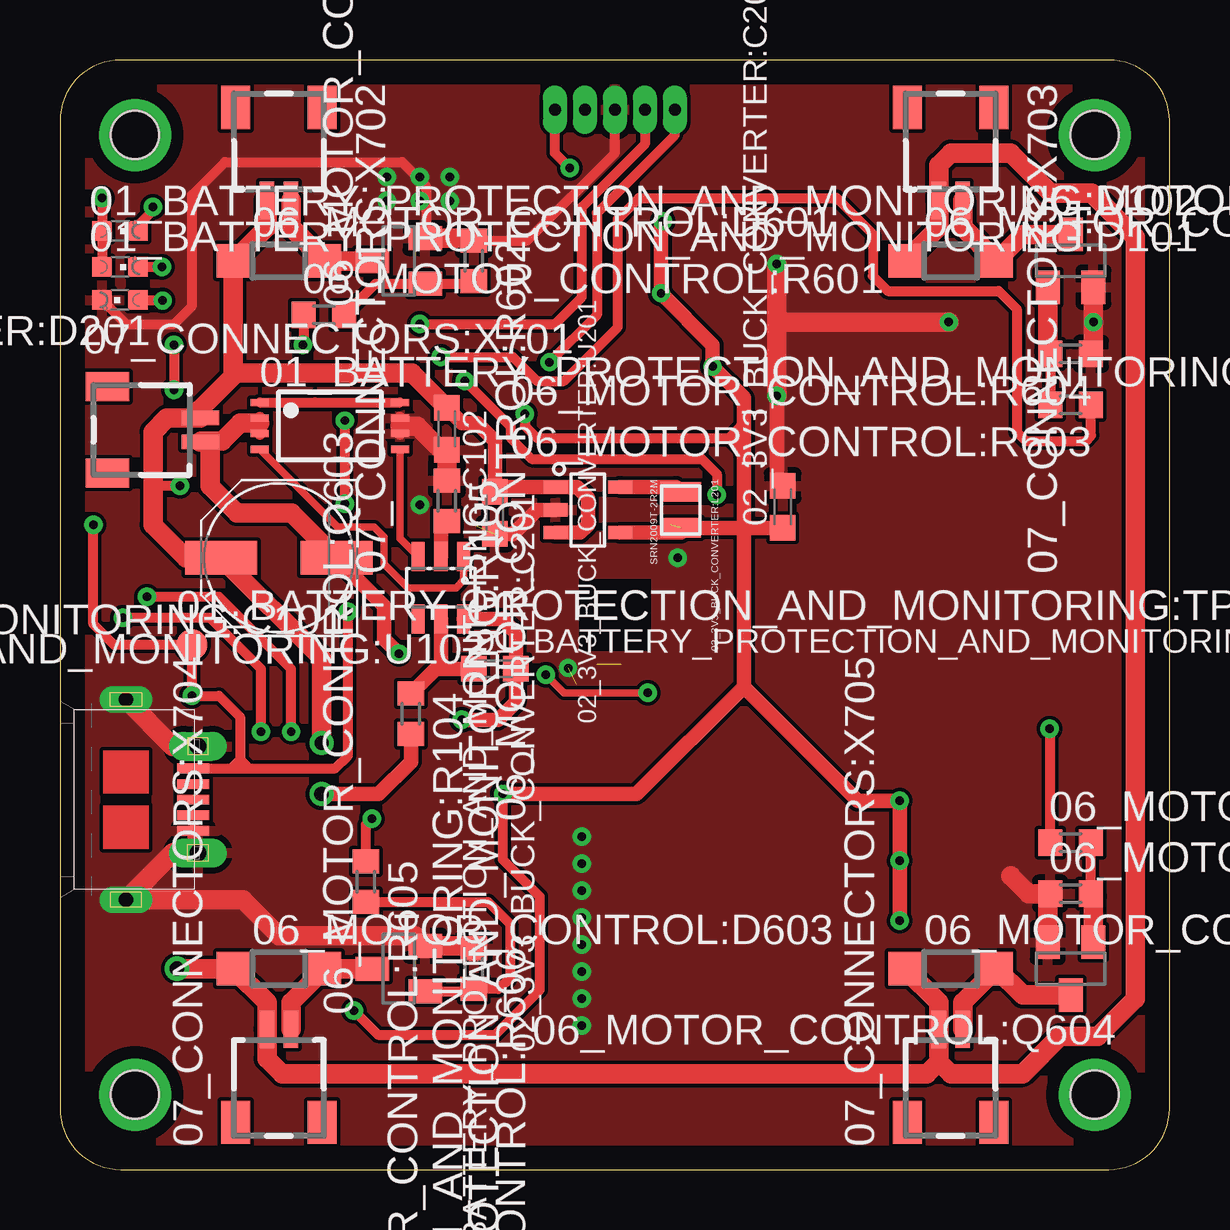
[diagram p8: board, top side]
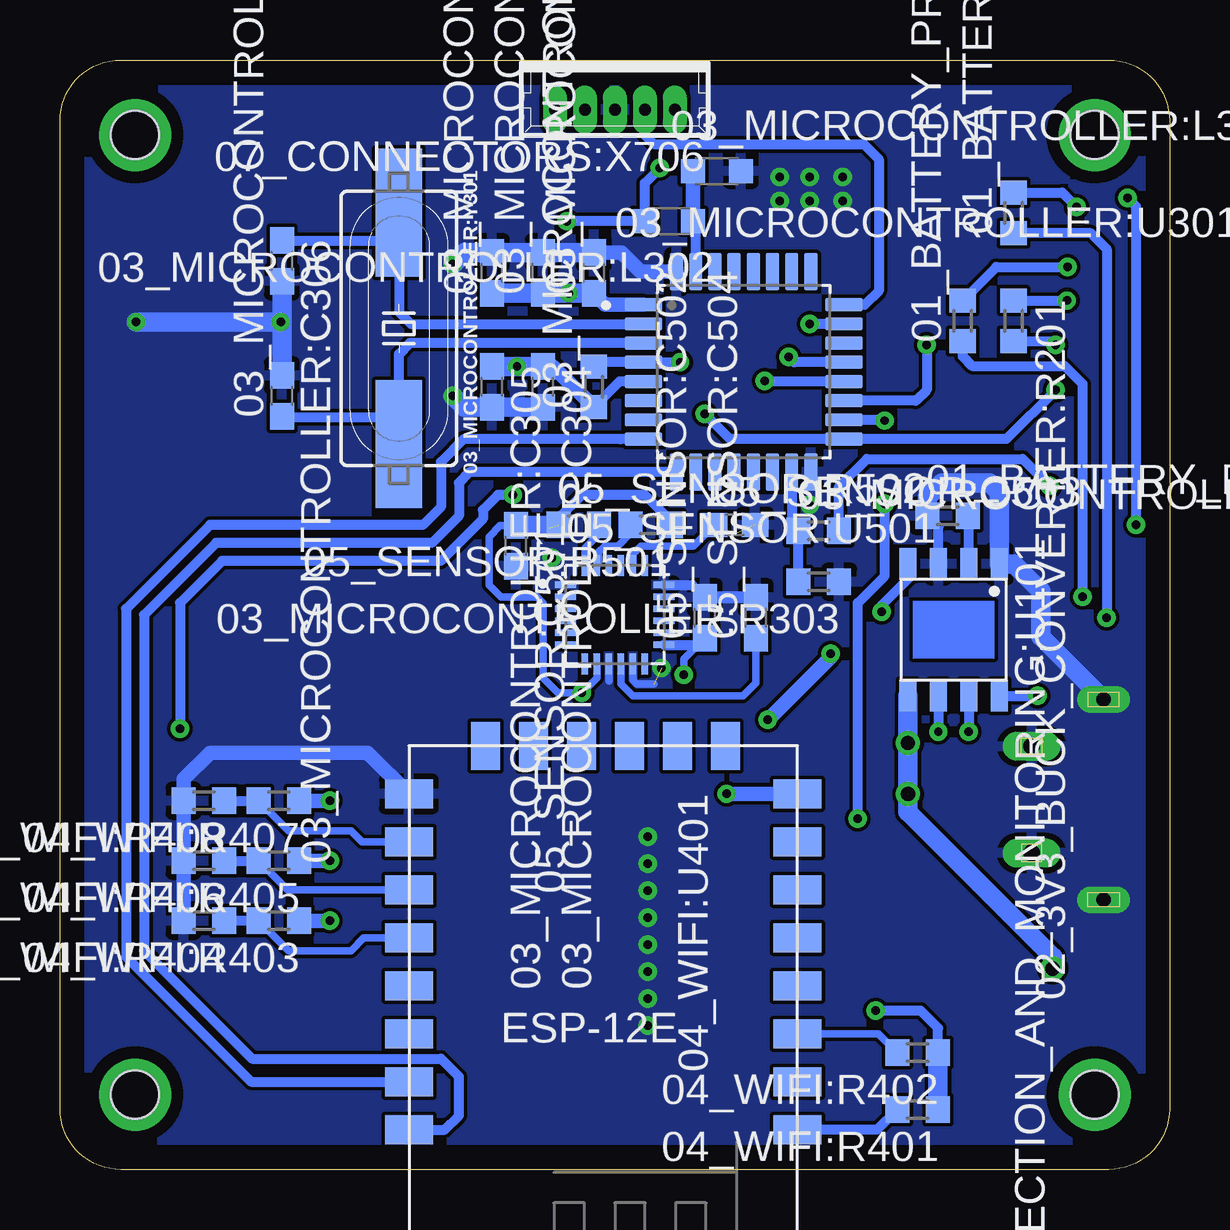
[diagram p9: board, bottom side, seen from below]

Size 46.25 x 46.25 mm. Coordinates in mm from the lower left corner, seen from the top.
Outline: 0,43.71 0,2.54 arc90 2.54,0 43.71,0 arc90 46.25,2.54 46.25,43.71 arc90 43.71,46.25 2.54,46.25 arc90 0,43.71
Copper layers (1*16): Top 0.035mm / dielectric 1.5mm / Bottom 0.035mm
Design rules "default *": minimum track width 6mil, minimum drill 0.35mm, track to track 6mil, track to pad 6mil, pad to pad 6mil, via to via 6mil, smd to smd 6mil, copper to edge 40mil, drill to drill 6mil, minimum pad ring 10mil, minimum via ring 8mil, stop-mask expansion 4mil, vias tented up to drill 0mil, thermal gap 10mil
Holes 2 mm at 3.12,3.12 43.12,3.12 43.12,43.12 3.12,43.12

### Footprints (pad centres in the part's own frame; a part is rotated, then mirrored left to right if it is on the bottom)
PANASONIC_D = smd 3 x 1.4: + 2.4,0; - -2.4,0
C0603K = smd 1.05 x 1.08: 1 -0.875,0; 2 0.875,0
CHIPLED_0603 = smd 0.8 x 0.8: A 0,-0.75; C 0,0.75
R0603 = smd 1 x 1.1: 1 -0.85,0; 2 0.85,0
TSSOP-8 = smd 0.3 x 0.75: 1 -0.975,-2.925; 2 -0.325,-2.925; 3 0.325,-2.925; 4 0.975,-2.925; 5 0.975,2.925; 6 0.325,2.925; 7 -0.325,2.925; 8 -0.975,2.925
B1,27 = smd 1.27 x 1.27: TP 0,0
SOP-8 = smd 1.3 x 0.7: 1 -2.75,1.905; 2 -2.75,0.635; 3 -2.75,-0.635; 4 -2.75,-1.905; 5 2.75,-1.905; 6 2.75,-0.635; 7 2.75,0.635; 8 2.75,1.905
SOT23-6 = smd 0.55 x 1.2: 1 -0.95,-1.3; 2 0,-1.3; 3 0.95,-1.3; 4 0.95,1.3; 5 0,1.3; 6 -0.95,1.3
SRN2009T-2R2M = smd 0.8 x 1.7: 1 -0.75,0; 2 0.75,0
SOT-23-5 = smd 1 x 0.55: 1 -1.35,0.95; 2 -1.35,0; 3 -1.35,-0.95; 4 1.35,-0.95; 5 1.35,0.95
C0603 = smd 1.1 x 1: 1 -0.85,0; 2 0.85,0
L2012C = smd 1 x 1: 1 -1,0; 2 1,0
QFP80P900X900X160-32N = smd 1.56 x 0.55: 1 -4.18,2.8; 2 -4.18,2; 3 -4.18,1.2; 4 -4.18,0.4; 5 -4.18,-0.4; 6 -4.18,-1.2; 7 -4.18,-2; 8 -4.18,-2.8; 17 4.18,-2.8; 18 4.18,-2; 19 4.18,-1.2; 20 4.18,-0.4; 21 4.18,0.4; 22 4.18,1.2; 23 4.18,2; 24 4.18,2.8 | smd 0.55 x 1.56: 9 -2.8,-4.18; 10 -2,-4.18; 11 -1.2,-4.18; 12 -0.4,-4.18; 13 0.4,-4.18; 14 1.2,-4.18; 15 2,-4.18; 16 2.8,-4.18; 25 2.8,4.18; 26 2,4.18; 27 1.2,4.18; 28 0.4,4.18; 29 -0.4,4.18; 30 -1.2,4.18; 31 -2,4.18; 32 -2.8,4.18
HC49UP = smd 5.334 x 1.93: 1 -4.826,0; 2 4.826,0
ESP8266-ESP12E = smd 2 x 1.2: 1 -7.62,5.84; 2 -7.62,3.84; 3 -7.62,1.84; 4 -7.62,-0.16; 5 -7.62,-2.16; 6 -7.62,-4.16; 7 -7.62,-6.16; 8 -7.62,-8.16; 9 8.58,-8.16; 10 8.58,-6.16; 11 8.58,-4.16; 12 8.58,-2.16; 13 8.58,-0.16; 14 8.58,1.84; 15 8.58,3.84; 16 8.58,5.84 | smd 1.2 x 2: 17 -4.62,-10.16; 18 -2.62,-10.16; 19 -0.62,-10.16; 20 1.38,-10.16; 21 3.38,-10.16; 22 5.38,-10.16
QFN50P400X400X95-24N = smd 0.866 x 0.26: 1 -2.046,1.25; 2 -2.046,0.75; 3 -2.046,0.25; 4 -2.046,-0.25; 5 -2.046,-0.75; 6 -2.046,-1.25; 13 2.046,-1.25; 14 2.046,-0.75; 15 2.046,-0.25; 16 2.046,0.25; 17 2.046,0.75; 18 2.046,1.25 | smd 0.26 x 0.866: 7 -1.25,-2.046; 8 -0.75,-2.046; 9 -0.25,-2.046; 10 0.25,-2.046; 11 0.75,-2.046; 12 1.25,-2.046; 19 1.25,2.046; 20 0.75,2.046; 21 0.25,2.046; 22 -0.25,2.046; 23 -0.75,2.046; 24 -1.25,2.046
SOD123 = smd 1.4 x 1.4: A 1.9,0; C -1.9,0
SOT23 = smd 1 x 1.4: 1 -0.95,-1.1; 2 0.95,-1.1; 3 0,1.1
47589-0001 = smd 1.35 x 0.4: 1 2.8,1.3; 2 2.8,0.65; 3 2.8,0; 4 2.8,-0.65; 5 2.8,-1.3 | drill 0.6 pad 0.95 long: CASING1 0,4.175; CASING2 0,-4.175 | drill 0.7 pad 1.1 long: CASING3 3,2.225; CASING4 3,-2.225
SM02B-SRSS-TB = smd 0.6 x 1.55: 1 -0.5,2.975; 2 0.5,2.975 | smd 1.2 x 1.8: FIT@1 -1.8,-0.9; FIT@2 1.8,-0.9
53047-05 = drill 0.5 pad 0.698 long: 1 2.5,0.45; 2 1.25,0.45; 3 0,0.45; 4 -1.25,0.45; 5 -2.5,0.45

### Placement (x,y rotation side)
01_BATTERY_PROTECTION_AND_MONITORING:C101  220uF  [PANASONIC_D]  9.12,25.5 180 top
01_BATTERY_PROTECTION_AND_MONITORING:C102  10uF  [C0603K]  16.12,30.88 270 top
01_BATTERY_PROTECTION_AND_MONITORING:C103  0.1uF  [C0603K]  18.12,20.88 0 top
01_BATTERY_PROTECTION_AND_MONITORING:D101  GREEN_LED  [CHIPLED_0603]  2.5,37.62 270 top
01_BATTERY_PROTECTION_AND_MONITORING:D102  RED_LED  [CHIPLED_0603]  2.5,39.12 270 top
01_BATTERY_PROTECTION_AND_MONITORING:R101  4.8KΩ  [R0603]  9.25,27.25 0 bottom
01_BATTERY_PROTECTION_AND_MONITORING:R102  1KΩ  [R0603]  8.62,35.38 90 bottom
01_BATTERY_PROTECTION_AND_MONITORING:R103  1KΩ  [R0603]  6.5,39.88 90 bottom
01_BATTERY_PROTECTION_AND_MONITORING:R104  100Ω  [R0603]  14.62,19 270 top
01_BATTERY_PROTECTION_AND_MONITORING:R105  1KΩ  [R0603]  16.12,27.88 270 top
01_BATTERY_PROTECTION_AND_MONITORING:T101  DMN3024LSD  [TSSOP-8]  11.25,31 270 top
01_BATTERY_PROTECTION_AND_MONITORING:TP_5V  TPB1,27  [B1,27]  5.5,21.88 0 top
01_BATTERY_PROTECTION_AND_MONITORING:U101  TP4056  [SOP-8]  9,22.5 270 bottom
01_BATTERY_PROTECTION_AND_MONITORING:U102  DW01A  [SOT23-6]  15.88,24.25 180 top
02_3V3_BUCK_CONVERTER:C201  [C0603K]  18.12,27.38 270 top
02_3V3_BUCK_CONVERTER:C202  [C0603K]  30.12,27.62 90 top
02_3V3_BUCK_CONVERTER:D201  GREEN_LED  [CHIPLED_0603]  2.5,36.25 90 top
02_3V3_BUCK_CONVERTER:L201  SRN2009T-2R2M  [SRN2009T-2R2M]  25.88,27.5 270 top
02_3V3_BUCK_CONVERTER:R201  [R0603]  6.5,35.38 270 bottom
02_3V3_BUCK_CONVERTER:U201  LM3670  [SOT-23-5]  22,27.5 0 top
03_MICROCONTROLLER:C301  100nF  [C0603]  24,37.38 90 bottom
03_MICROCONTROLLER:C302  100nF  [C0603]  26.12,37.38 90 bottom
03_MICROCONTROLLER:C303  4.7uF  [C0603]  28.25,37.38 90 bottom
03_MICROCONTROLLER:C304  10nF  [C0603]  26.12,32.62 270 bottom
03_MICROCONTROLLER:C305  1uF  [C0603]  28.25,32.62 270 bottom
03_MICROCONTROLLER:C306  20pF  [C0603]  37,37.88 270 bottom
03_MICROCONTROLLER:C307  20pF  [C0603]  37,32.25 90 bottom
03_MICROCONTROLLER:L302  [L2012C]  20.88,39.52 180 bottom
03_MICROCONTROLLER:L303  [L2012C]  18.88,41.62 0 bottom
03_MICROCONTROLLER:R301  10KΩ  [R0603]  24,32.62 90 bottom
03_MICROCONTROLLER:R302  2KΩ  [R0603]  14.62,26.62 0 bottom
03_MICROCONTROLLER:R303  5KΩ  [R0603]  14.62,24.5 180 bottom
03_MICROCONTROLLER:U301  STM32F030K6T6  [QFP80P900X900X160-32N]  17.75,33.25 0 bottom
03_MICROCONTROLLER:Y301  8MHz  [HC49UP]  32.12,35.06 270 bottom
04_WIFI:R401  10KΩ  [R0603]  10.5,2.5 180 bottom
04_WIFI:R402  10KΩ  [R0603]  10.5,4.88 180 bottom
04_WIFI:R403  10KΩ  [R0603]  37.12,10.38 180 bottom
04_WIFI:R404  10KΩ  [R0603]  40.25,10.38 180 bottom
04_WIFI:R405  10KΩ  [R0603]  37.12,12.88 180 bottom
04_WIFI:R406  10KΩ  [R0603]  40.25,12.88 180 bottom
04_WIFI:R407  10KΩ  [R0603]  37.12,15.38 180 bottom
04_WIFI:R408  10KΩ  [R0603]  40.25,15.38 180 bottom
04_WIFI:U401  [ESP8266-ESP12E]  23.12,7.5 180 bottom
05_SENSOR:C501  0.1uF, 4V, ±10%  [C0603]  27.25,26 270 bottom
05_SENSOR:C502  10nF, 4V, ±10%  [C0603]  19.38,23 90 bottom
05_SENSOR:C503  2.2nF, 50V, ±10%  [C0603]  18.12,26.88 0 bottom
05_SENSOR:C504  0.1uF, 2V, ±10%  [C0603]  17.25,23 90 bottom
05_SENSOR:R501  4.7k  [R0603]  21.62,26.88 180 bottom
05_SENSOR:R502  4.7k  [R0603]  24.62,26.88 0 bottom
05_SENSOR:U501  MPU-6050  [QFN50P400X400X95-24N]  23.12,23.12 0 bottom
06_MOTOR_CONTROL:D601  [SOD123]  9.12,37.88 0 top
06_MOTOR_CONTROL:D602  [SOD123]  37.12,37.88 0 top
06_MOTOR_CONTROL:D603  [SOD123]  9.12,8.38 0 top
06_MOTOR_CONTROL:D604  [SOD123]  37.12,8.38 0 top
06_MOTOR_CONTROL:Q601  [SOT23]  14.12,37.88 90 top
06_MOTOR_CONTROL:Q602  [SOT23]  42.12,37.88 0 top
06_MOTOR_CONTROL:Q603  [SOT23]  14.12,8.38 90 top
06_MOTOR_CONTROL:Q604  [SOT23]  42.12,8.38 180 top
06_MOTOR_CONTROL:R601  [R0603]  11,35.62 0 top
06_MOTOR_CONTROL:R602  [R0603]  17.25,37.88 270 top
06_MOTOR_CONTROL:R603  [R0603]  42.12,31.88 180 top
06_MOTOR_CONTROL:R604  [R0603]  42.12,34 180 top
06_MOTOR_CONTROL:R605  [R0603]  12.75,12 270 top
06_MOTOR_CONTROL:R606  [R0603]  17.25,8.38 270 top
06_MOTOR_CONTROL:R607  [R0603]  42.12,13.62 0 top
06_MOTOR_CONTROL:R608  [R0603]  42.12,11.5 0 top
07_CONNECTORS:J701  MICRO-USB  [47589-0001]  2.75,15.42 0 top
07_CONNECTORS:X701  Battery Connector  [SM02B-SRSS-TB]  2.88,30.83 270 top
07_CONNECTORS:X702  Motor 1  [SM02B-SRSS-TB]  9.12,43.38 180 top
07_CONNECTORS:X703  Motor 2  [SM02B-SRSS-TB]  37.12,43.38 180 top
07_CONNECTORS:X704  Motor 3  [SM02B-SRSS-TB]  9.12,2.88 0 top
07_CONNECTORS:X705  Motor 4  [SM02B-SRSS-TB]  37.12,2.88 0 top
07_CONNECTORS:X706  JTAG  [53047-05]  23.12,44.62 180 bottom

### Tracks (layer width: path | path; a pad name or v marks a point on that pad's centre or on a via)
01_BATTERY_PROTECTION_AND_MONITORING:CHRG  (via drill 0.35)
  Top 0.406: v8.38,18.25 8.38,20.88 6.25,23 v2.62,23
  Bottom 0.406: 01_BATTERY_PROTECTION_AND_MONITORING:U101.7 v8.38,18.25 | v2.62,23 2.62,38.38 3.27,39.02 01_BATTERY_PROTECTION_AND_MONITORING:R103.1
01_BATTERY_PROTECTION_AND_MONITORING:CHRG_LED  (via drill 0.35)
  Top 0.406: v3.88,40.12 3.88,40 3.25,39.38 01_BATTERY_PROTECTION_AND_MONITORING:D102.C
  Bottom 0.406: 01_BATTERY_PROTECTION_AND_MONITORING:R103.2 4.47,40.73 v3.88,40.12
01_BATTERY_PROTECTION_AND_MONITORING:CS
  Top 0.61: 01_BATTERY_PROTECTION_AND_MONITORING:U102.2 15.88,26.77 01_BATTERY_PROTECTION_AND_MONITORING:R105.2
01_BATTERY_PROTECTION_AND_MONITORING:N$6
  Top 0.406: 01_BATTERY_PROTECTION_AND_MONITORING:T101.1 10.62,31.98 01_BATTERY_PROTECTION_AND_MONITORING:T101.8
01_BATTERY_PROTECTION_AND_MONITORING:OC
  Top 0.305: 01_BATTERY_PROTECTION_AND_MONITORING:T101.5 14.18,26.3 01_BATTERY_PROTECTION_AND_MONITORING:U102.3
01_BATTERY_PROTECTION_AND_MONITORING:OD
  Top 0.305: 01_BATTERY_PROTECTION_AND_MONITORING:T101.4 11.57,26.77 13.1,26.77 13.5,26.38 13.5,25.25 14.5,24.25 16.5,24.25 16.82,24.57 01_BATTERY_PROTECTION_AND_MONITORING:U102.1
01_BATTERY_PROTECTION_AND_MONITORING:PROG
  Bottom 0.406: 01_BATTERY_PROTECTION_AND_MONITORING:U101.2 8.37,27.21 01_BATTERY_PROTECTION_AND_MONITORING:R101.2
01_BATTERY_PROTECTION_AND_MONITORING:STDBY  (via drill 0.35)
  Top 0.406: v9.63,18.25 9.63,20.86 6.62,23.88 v3.62,23.88
  Bottom 0.406: 01_BATTERY_PROTECTION_AND_MONITORING:U101.6 v9.63,18.25 | v3.62,23.88 3.62,32.75 4.38,33.5 8.22,33.5 8.62,33.9 01_BATTERY_PROTECTION_AND_MONITORING:R102.1
01_BATTERY_PROTECTION_AND_MONITORING:STDBY_LED  (via drill 0.35)
  Top 0.406: v4.25,37.62 01_BATTERY_PROTECTION_AND_MONITORING:D101.C
  Bottom 0.406: 01_BATTERY_PROTECTION_AND_MONITORING:R102.2 7.22,37.62 v4.25,37.62
01_BATTERY_PROTECTION_AND_MONITORING:VCC
  Top 0.61: 15.65,20.88 01_BATTERY_PROTECTION_AND_MONITORING:C103.1 | 01_BATTERY_PROTECTION_AND_MONITORING:R104.1 15.65,20.88 | 01_BATTERY_PROTECTION_AND_MONITORING:U102.5 15.88,21.1 15.65,20.88
02_3V3_BUCK_CONVERTER:LED_3V3  (via drill 0.35)
  Top 0.406: v4.28,36.23 3.27,36.23 02_3V3_BUCK_CONVERTER:D201.A
  Bottom 0.406: 02_3V3_BUCK_CONVERTER:R201.1 v4.28,36.23
02_3V3_BUCK_CONVERTER:SW
  Top 0.61: 02_3V3_BUCK_CONVERTER:U201.5 25.68,28.45 02_3V3_BUCK_CONVERTER:L201.1
03_MICROCONTROLLER:BAT_MON
  Bottom 0.406: 03_MICROCONTROLLER:U301.15 15.75,26.9 03_MICROCONTROLLER:R302.1 03_MICROCONTROLLER:R303.2
03_MICROCONTROLLER:BOOT0
  Bottom 0.406: 03_MICROCONTROLLER:U301.31 19.75,39.4 03_MICROCONTROLLER:L302.1
  Bottom 0.61: 03_MICROCONTROLLER:L303.1 03_MICROCONTROLLER:L302.1
03_MICROCONTROLLER:XTAL_IN
  Bottom 0.406: 03_MICROCONTROLLER:U301.2 31.62,35.25 32.12,35.75 03_MICROCONTROLLER:Y301.1 32.12,38.73 03_MICROCONTROLLER:C306.1
03_MICROCONTROLLER:XTAL_OUT
  Bottom 0.406: 03_MICROCONTROLLER:U301.3 31.68,34.45 32.12,34 03_MICROCONTROLLER:Y301.2 32.12,31.38 36.98,31.38 03_MICROCONTROLLER:C307.1
04_WIFI:CH_PD
  Bottom 0.305: 04_WIFI:R402.2 12.13,5.66 04_WIFI:U401.3
04_WIFI:GPIO0
  Bottom 0.305: 04_WIFI:U401.12 33.59,9.66 34.12,9.12 36.73,9.12 04_WIFI:R403.2
  Bottom 0.406: 04_WIFI:R403.2 04_WIFI:R404.1
04_WIFI:GPIO2
  Bottom 0.305: 04_WIFI:U401.11 36.76,11.66 04_WIFI:R405.2
  Bottom 0.406: 04_WIFI:R406.1 04_WIFI:R405.2
04_WIFI:GPIO15
  Bottom 0.305: 04_WIFI:R407.2 36.73,14.12 34.12,14.12 33.66,13.66 04_WIFI:U401.10
  Bottom 0.406: 04_WIFI:R408.1 04_WIFI:R407.2
04_WIFI:RST_ESP8266
  Bottom 0.406: 04_WIFI:R401.2 12.19,1.66 04_WIFI:U401.1
05_SENSOR:CPOUT
  Bottom 0.305: 05_SENSOR:C503.1 19.85,26 22.04,26 22.38,25.66 05_SENSOR:U501.20
05_SENSOR:REGOUT
  Bottom 0.305: 05_SENSOR:U501.10 22.88,20.25 22.38,19.75 17.77,19.75 17.25,20.27 05_SENSOR:C504.1
05_SENSOR:SCL
  Bottom 0.305: 05_SENSOR:U501.23 23.81,25.24 23.81,25.73 23.54,26 23,26 22.48,26.52 05_SENSOR:R501.2
05_SENSOR:SDA
  Bottom 0.305: 05_SENSOR:U501.24 24.38,25.9 23.77,26.5 05_SENSOR:R502.2
06_MOTOR_CONTROL:M1_GATE
  Top 0.406: 06_MOTOR_CONTROL:R601.2 13.15,36.92 06_MOTOR_CONTROL:Q601.1 17.15,36.92 06_MOTOR_CONTROL:R602.2
06_MOTOR_CONTROL:M2_GATE
  Top 0.406: 06_MOTOR_CONTROL:R604.2 06_MOTOR_CONTROL:R603.2
  Top 0.813: 06_MOTOR_CONTROL:Q602.1 41.17,34.1 06_MOTOR_CONTROL:R604.2
06_MOTOR_CONTROL:M3_GATE
  Top 0.406: 06_MOTOR_CONTROL:Q603.1 17.15,7.42 06_MOTOR_CONTROL:R606.2 18.27,7.53 18.75,8 18.75,10.25 17.85,11.15 06_MOTOR_CONTROL:R605.2
06_MOTOR_CONTROL:M4_GATE
  Top 0.406: 06_MOTOR_CONTROL:R608.2 06_MOTOR_CONTROL:R607.2
  Top 0.813: 06_MOTOR_CONTROL:Q604.1 43.08,11.4 06_MOTOR_CONTROL:R608.2
+3V3  (via drill 0.35)  (1 unrouted)
  Top 0.305: v20.25,20.62 21,19.88 v24.5,19.88
  Top 0.406: v25.05,36.52 25.12,36.5 | v19.38,31.5 19.38,31 19.88,30.5 27.88,30.5 | v12.25,6.62 13.25,5.62 18.12,5.62 20,7.5 20,11.38 18.46,12.91 v18.46,15.66 | v4.75,34.38 v4.75,32.5 | v21.25,41.75 20.62,42.38 07_CONNECTORS:X706.5 | 28.5,30.5 27.88,30.5 | 27.88,30.5 28.38,31 28.5,31 | 27.88,30.5 28.5,29.88
  Top 0.61: v25.12,39.52 25.05,39.45 v25.05,36.52 27.2,34.38 v27.2,33.48 28.5,32.17 28.5,31 28.5,30.5 28.5,29.88 28.5,26.75 | v35,10.38 v35,12.88 v35,15.38 33.25,15.38 28.5,20.12 | 28.5,26.75 02_3V3_BUCK_CONVERTER:L201.2 25.88,26.55 02_3V3_BUCK_CONVERTER:U201.4 | 02_3V3_BUCK_CONVERTER:C202.1 28.5,26.75 | 28.5,26.75 28.5,20.12 | v18.46,15.66 24.04,15.66 28.5,20.12
  Bottom 0.305: 05_SENSOR:U501.8 23.88,20.5 v24.5,19.88 25.5,19.88 26.12,20.5 26.12,23.62 26.38,23.88 27.88,23.88 28.38,24.38 28.38,26.38 27.9,26.85 05_SENSOR:C501.1 | 05_SENSOR:C502.1 20.25,21.27 v20.25,20.62
  Bottom 0.406: v25.12,39.52 03_MICROCONTROLLER:L302.2 21.88,41.12 v21.25,41.75 | 05_SENSOR:U501.13 19.65,21.88 05_SENSOR:C502.1 | 03_MICROCONTROLLER:U301.5 22.93,32.85 03_MICROCONTROLLER:R301.1 | 05_SENSOR:R501.1 20.77,27.02 21.88,28.12 24.5,28.12 25.48,27.15 05_SENSOR:R502.1 | v19.38,31.5 18.32,30.45 03_MICROCONTROLLER:U301.17 6.8,30.45 v4.75,32.5 | 04_WIFI:R402.1 9.65,5.9 10.38,6.62 v12.25,6.62 | 02_3V3_BUCK_CONVERTER:R201.2 4.9,34.52 v4.75,34.38
  Bottom 0.61: 03_MICROCONTROLLER:U301.1 23.52,36.05 03_MICROCONTROLLER:C301.1 | 03_MICROCONTROLLER:R301.1 25.7,33.48 03_MICROCONTROLLER:C304.1 | 04_WIFI:R403.1 v35,10.38 | 04_WIFI:R405.1 v35,12.88 | 04_WIFI:R407.1 v35,15.38 | 04_WIFI:U401.8 v18.46,15.66
  Bottom 0.813: 03_MICROCONTROLLER:C301.1 v25.05,36.52 03_MICROCONTROLLER:C302.1 03_MICROCONTROLLER:C303.1 | 03_MICROCONTROLLER:C304.1 v27.2,33.48 03_MICROCONTROLLER:C305.1 | 04_WIFI:R402.1 04_WIFI:R401.1 | 05_SENSOR:C501.1 25.5,26.85 05_SENSOR:R502.1
+5V  (via drill 0.35)
  Top 0.406: 07_CONNECTORS:J701.1 7.12,16.72 | 7.12,16.72 7.5,16.72 | 7.5,16.72 7.75,16.72 | 7.75,16.72 11.47,16.72 12,17.25 v12,23.25 | 7.5,17.09 7.5,18.88 6.62,19.75 v5.5,19.75 01_BATTERY_PROTECTION_AND_MONITORING:TP_5V.TP 2.25,21.88 1.39,22.73 v1.39,26.88 | 7.5,17.09 7.5,16.72 | 7.12,16.72 7.5,17.09 | 7.75,16.72 7.75,16.84 7.5,17.09 | 01_BATTERY_PROTECTION_AND_MONITORING:D101.A 01_BATTERY_PROTECTION_AND_MONITORING:D102.A v1.75,40.5
  Bottom 0.406: v12,23.25 12,23.53 10.9,24.62 01_BATTERY_PROTECTION_AND_MONITORING:U101.4 | 01_BATTERY_PROTECTION_AND_MONITORING:U101.8 v5.5,19.75 | v1.39,26.88 1.39,40.14 v1.75,40.5
BATTERY_+VE  (via drill 0.35, 0.6)  (1 unrouted)
  Top 0.406: v5,28.5 3.88,28.5
  Top 0.61: 02_3V3_BUCK_CONVERTER:U201.3 21.68,26.55 22,26.88 22,28 21.55,28.45 02_3V3_BUCK_CONVERTER:U201.1 18.32,28.45 02_3V3_BUCK_CONVERTER:C201.1 18.12,30.38 17.38,31.12 16.75,31.12 01_BATTERY_PROTECTION_AND_MONITORING:C102.1 | v10.9,15.65 13.28,15.65 14.62,17 01_BATTERY_PROTECTION_AND_MONITORING:R104.2
  Top 0.813: 06_MOTOR_CONTROL:D604.C 36.62,6.97 07_CONNECTORS:X705.1 36.62,4.5 | 07_CONNECTORS:X702.2 8.62,39.27 06_MOTOR_CONTROL:D601.C 7.22,33.2 7.35,33.2 | 06_MOTOR_CONTROL:D602.C 36.62,39.27 07_CONNECTORS:X703.2 36.62,41.88 37.12,42.38 39.62,42.38 41.3,40.7 43,40.7 44.83,38.88 44.83,7.12 43.25,5.55 41.67,5.55 40.12,4 37.12,4 36.62,4.5 | 36.62,4.5 36.12,4 9.25,4 8.62,4.62 07_CONNECTORS:X704.1 8.62,6.97 06_MOTOR_CONTROL:D603.C v4.88,8.38 | 7.35,33.2 5.85,31.7 07_CONNECTORS:X701.1 4.46,31.33 3.88,30.75 3.88,28.5 3.88,26.88 5.25,25.5 01_BATTERY_PROTECTION_AND_MONITORING:C101.+ 10.9,21.32 v10.9,17.78 | 01_BATTERY_PROTECTION_AND_MONITORING:C102.1 14.67,33.2 7.35,33.2
  Bottom 0.406: 03_MICROCONTROLLER:R302.2 13.78,28.48 12.62,29.62 6.12,29.62 v5,28.5
  Bottom 0.813: 01_BATTERY_PROTECTION_AND_MONITORING:U101.5 v10.9,17.78 v10.9,15.65 | v4.88,8.38 4.88,8.88 10.9,14.9 v10.9,15.65
BATTERY_-VE  (via drill 0.35)
  Top 0.508: 01_BATTERY_PROTECTION_AND_MONITORING:T101.2 8.32,31.12 01_BATTERY_PROTECTION_AND_MONITORING:T101.3
  Top 0.61: 01_BATTERY_PROTECTION_AND_MONITORING:U102.6 18.43,22.95 19,22.38 01_BATTERY_PROTECTION_AND_MONITORING:C103.2 19,19.5 18.25,18.75 v16.75,18.75 | v14.12,21.5 13.5,22.12 13.5,23.5 11.53,25.48 01_BATTERY_PROTECTION_AND_MONITORING:C101.-
  Top 0.813: 07_CONNECTORS:X701.2 5.88,30.36 6.25,30.36 | 8.32,31.12 7.51,31.12 6.75,30.36 6.25,30.36 | 01_BATTERY_PROTECTION_AND_MONITORING:C101.- 9.65,27.38 7.38,27.38 6.25,28.5 6.25,30.36
  Bottom 0.61: v16.75,18.75 14.12,21.38 v14.12,21.5
GND  (via drill 0.35)  (3 unrouted)
  Top 0.406: 02_3V3_BUCK_CONVERTER:D201.C 2.75,35.25 4.75,35.25 5.5,36 5.5,40.62 6.88,42 14.25,42 15.25,41 15.25,38.85 06_MOTOR_CONTROL:Q601.2 | 06_MOTOR_CONTROL:R602.1 19.48,38.73 23.12,42.38 07_CONNECTORS:X706.3
  Top 0.508: 07_CONNECTORS:J701.5 5.55,13.68 07_CONNECTORS:J701.CASING4 | 01_BATTERY_PROTECTION_AND_MONITORING:T101.7 14.18,31 01_BATTERY_PROTECTION_AND_MONITORING:T101.6
  Top 0.61: 16.12,29.98 01_BATTERY_PROTECTION_AND_MONITORING:C102.2 | 02_3V3_BUCK_CONVERTER:C201.2 18.88,26.5 19.88,27.5 02_3V3_BUCK_CONVERTER:U201.2 | 02_3V3_BUCK_CONVERTER:C202.2 29.88,28.75 v29.88,32.25
  Top 0.813: 06_MOTOR_CONTROL:Q601.2 17.15,38.83 06_MOTOR_CONTROL:R602.1 | 06_MOTOR_CONTROL:R606.1 17.15,9.32 06_MOTOR_CONTROL:Q603.2 14.8,9.75 9.12,9.75 7.63,11.24 07_CONNECTORS:J701.CASING2 4.7,13.2 07_CONNECTORS:J701.CASING4 | 06_MOTOR_CONTROL:Q602.2 v43.08,35.33 43.08,34.1 06_MOTOR_CONTROL:R604.1 | 06_MOTOR_CONTROL:Q604.2 41.17,11.4 06_MOTOR_CONTROL:R608.1 40.38,11.5 39.62,12.25 | 07_CONNECTORS:J701.CASING1 4.7,17.64 07_CONNECTORS:J701.CASING3 | 01_BATTERY_PROTECTION_AND_MONITORING:C102.2 16.12,29.75 | v29.88,32.25 29.88,35.25 | 29.88,35.25 v29.88,37.75 | v37.05,35.33 29.95,35.33 29.88,35.25 | 14.18,31 14.88,31 16.12,29.75 | 16.12,29.75 01_BATTERY_PROTECTION_AND_MONITORING:R105.1
  Bottom 0.305: 05_SENSOR:U501.9 23.38,20.38 | 21.5,20.25 22.22,20.25 22.38,20.41 05_SENSOR:U501.11
  Bottom 0.406: 05_SENSOR:U501.18 19.9,24.38 05_SENSOR:C502.2 | 01_BATTERY_PROTECTION_AND_MONITORING:U101.3 9.63,26.79 01_BATTERY_PROTECTION_AND_MONITORING:R101.1
  Bottom 0.508: 05_SENSOR:C504.2 05_SENSOR:C502.2
  Bottom 0.61: 03_MICROCONTROLLER:U301.32 22.05,37.43 22.85,38.23 03_MICROCONTROLLER:C301.2 | 04_WIFI:R404.2 04_WIFI:R406.2 04_WIFI:R408.2 41.1,16.27 40,17.38 33.42,17.38 04_WIFI:U401.9
  Bottom 0.813: 03_MICROCONTROLLER:C301.2 03_MICROCONTROLLER:C302.2 03_MICROCONTROLLER:C303.2 29.4,38.23 v29.88,37.75 | 03_MICROCONTROLLER:C304.2 03_MICROCONTROLLER:C305.2 29.4,31.77 v29.88,32.25 | 07_CONNECTORS:J701.CASING1 5.38,22.22 5.38,24.12 6.5,25.25 01_BATTERY_PROTECTION_AND_MONITORING:U101.1 7.09,26.46 7.09,26.47 7.09,28.22 7.5,28.62 9.5,28.62 10.1,28.02 01_BATTERY_PROTECTION_AND_MONITORING:R101.1 | 03_MICROCONTROLLER:C306.2 37,35.38 | 03_MICROCONTROLLER:C307.2 37,35.38 | v43.08,35.33 v37.05,35.33 37,35.38
  other vias: 25.75,25.5 21.18,20.9 13.62,41.38 13.62,40.38 15,41.38 15,40.38 16.25,40.38 16.25,41.38 15,27.71 21.75,13.88 21.75,12.75 21.75,11.62 21.75,10.5 21.75,9.38 21.75,8.25 21.75,7.12 21.75,6
  pour Bottom: 0,46.25 46.25,46.25 46.25,0 0,0
  pour Top: 0,46.25 46.25,46.25 46.25,0 0,0
M1
  Top 0.813: 07_CONNECTORS:X702.1 9.62,39.27 06_MOTOR_CONTROL:D601.A 06_MOTOR_CONTROL:Q601.3
M1_PWM  (via drill 0.35)
  Top 0.406: 06_MOTOR_CONTROL:R601.1 10.15,34.4 v10.12,34.38
  Bottom 0.406: v10.12,34.38 10.12,32.5 10.57,32.05 03_MICROCONTROLLER:U301.19
M2
  Top 0.813: 07_CONNECTORS:X703.1 37.62,39.27 06_MOTOR_CONTROL:D602.A 40.12,38.98 06_MOTOR_CONTROL:Q602.3
M2_PWM  (via drill 0.35)
  Top 0.406: v15.88,33.88 18.88,33.88 19.88,32.88 21,32.88 23.25,35.12 23.25,39.62 24.12,40.5 32.38,40.5 33.88,39 33.88,37.25 34.5,36.62 39.12,36.62 39.88,35.88 39.88,30.75 40.25,30.38 42.75,30.38 42.98,30.6 06_MOTOR_CONTROL:R603.1
  Bottom 0.406: 03_MICROCONTROLLER:U301.21 15.65,33.65 v15.88,33.88
M3
  Top 0.813: 07_CONNECTORS:X704.2 9.62,6.97 06_MOTOR_CONTROL:D603.A 06_MOTOR_CONTROL:Q603.3
M3_PWM  (via drill 0.35)
  Top 0.406: 06_MOTOR_CONTROL:R605.1 12.75,14.38 v13,14.62 | v11.88,27.75 v11.88,31.22
  Bottom 0.406: v13,14.62 13,23.62 11.88,24.75 v11.88,27.75 | v11.88,31.22 11.94,31.25 03_MICROCONTROLLER:U301.18
M4
  Top 0.813: 07_CONNECTORS:X705.2 37.62,6.97 06_MOTOR_CONTROL:D604.A 40.12,7.28 06_MOTOR_CONTROL:Q604.3
M4_PWM  (via drill 0.35)
  Top 0.406: v27.38,28.12 27.38,29 26.75,29.62 19.66,29.62 18.79,30.5 18.79,30.96 v16.88,32.88 | v41.25,18.38 41.25,13.65 06_MOTOR_CONTROL:R607.1
  Bottom 0.406: 03_MICROCONTROLLER:U301.20 16.85,32.85 v16.88,32.88 | v27.38,28.12 28,28.12 28.62,27.5 28.62,27.12 30.38,25.38 39.5,25.38 41.25,23.62 v41.25,18.38
N$1  (via drill 2 pad 3)
  other vias: 3.12,3.12
N$5  (via drill 2 pad 3)
  other vias: 3.12,43.12
N$6  (via drill 2 pad 3)
  other vias: 43.12,3.12
N$7  (via drill 2 pad 3)
  other vias: 43.12,43.12
NRST  (via drill 0.35)
  Top 0.406: v20.4,33.65 22.38,35.62 22.38,39.88 25.62,43.12 07_CONNECTORS:X706.1
  Bottom 0.406: 03_MICROCONTROLLER:R301.2 23.82,33.65 03_MICROCONTROLLER:U301.4 v20.4,33.65
SWCLK
  Bottom 0.406: 07_CONNECTORS:X706.4 21.88,43.12 21.5,42.75 12.75,42.75 12.12,42.12 12.12,36.62 12.7,36.05 03_MICROCONTROLLER:U301.24
SWDIO  (via drill 0.35)
  Top 0.406: 07_CONNECTORS:X706.2 24.38,42.75 21.75,40.12 21.75,36.38 20.62,35.25 v15,35.25
  Bottom 0.406: 03_MICROCONTROLLER:U301.23 v15,35.25
UART1_RX
  Bottom 0.406: 04_WIFI:U401.16 30.21,1.66 29.62,2.25 29.62,3.88 30.38,4.62 38.25,4.62 42.75,9.12 42.75,23.12 39.75,26.12 30.75,26.12 29.62,27.25 29.62,28.62 29.18,29.07 03_MICROCONTROLLER:U301.9
UART1_TX
  Bottom 0.406: 03_MICROCONTROLLER:U301.8 22.89,30.45 22.89,30.44 29.43,30.44 30.38,29.5 30.38,27.62 31.12,26.88 40,26.88 43.5,23.38 43.5,8.88 38.28,3.66 04_WIFI:U401.15